# EAGLE schematic aleph-130111 (EAGLE 5.11)

## Sheet 1 of 8
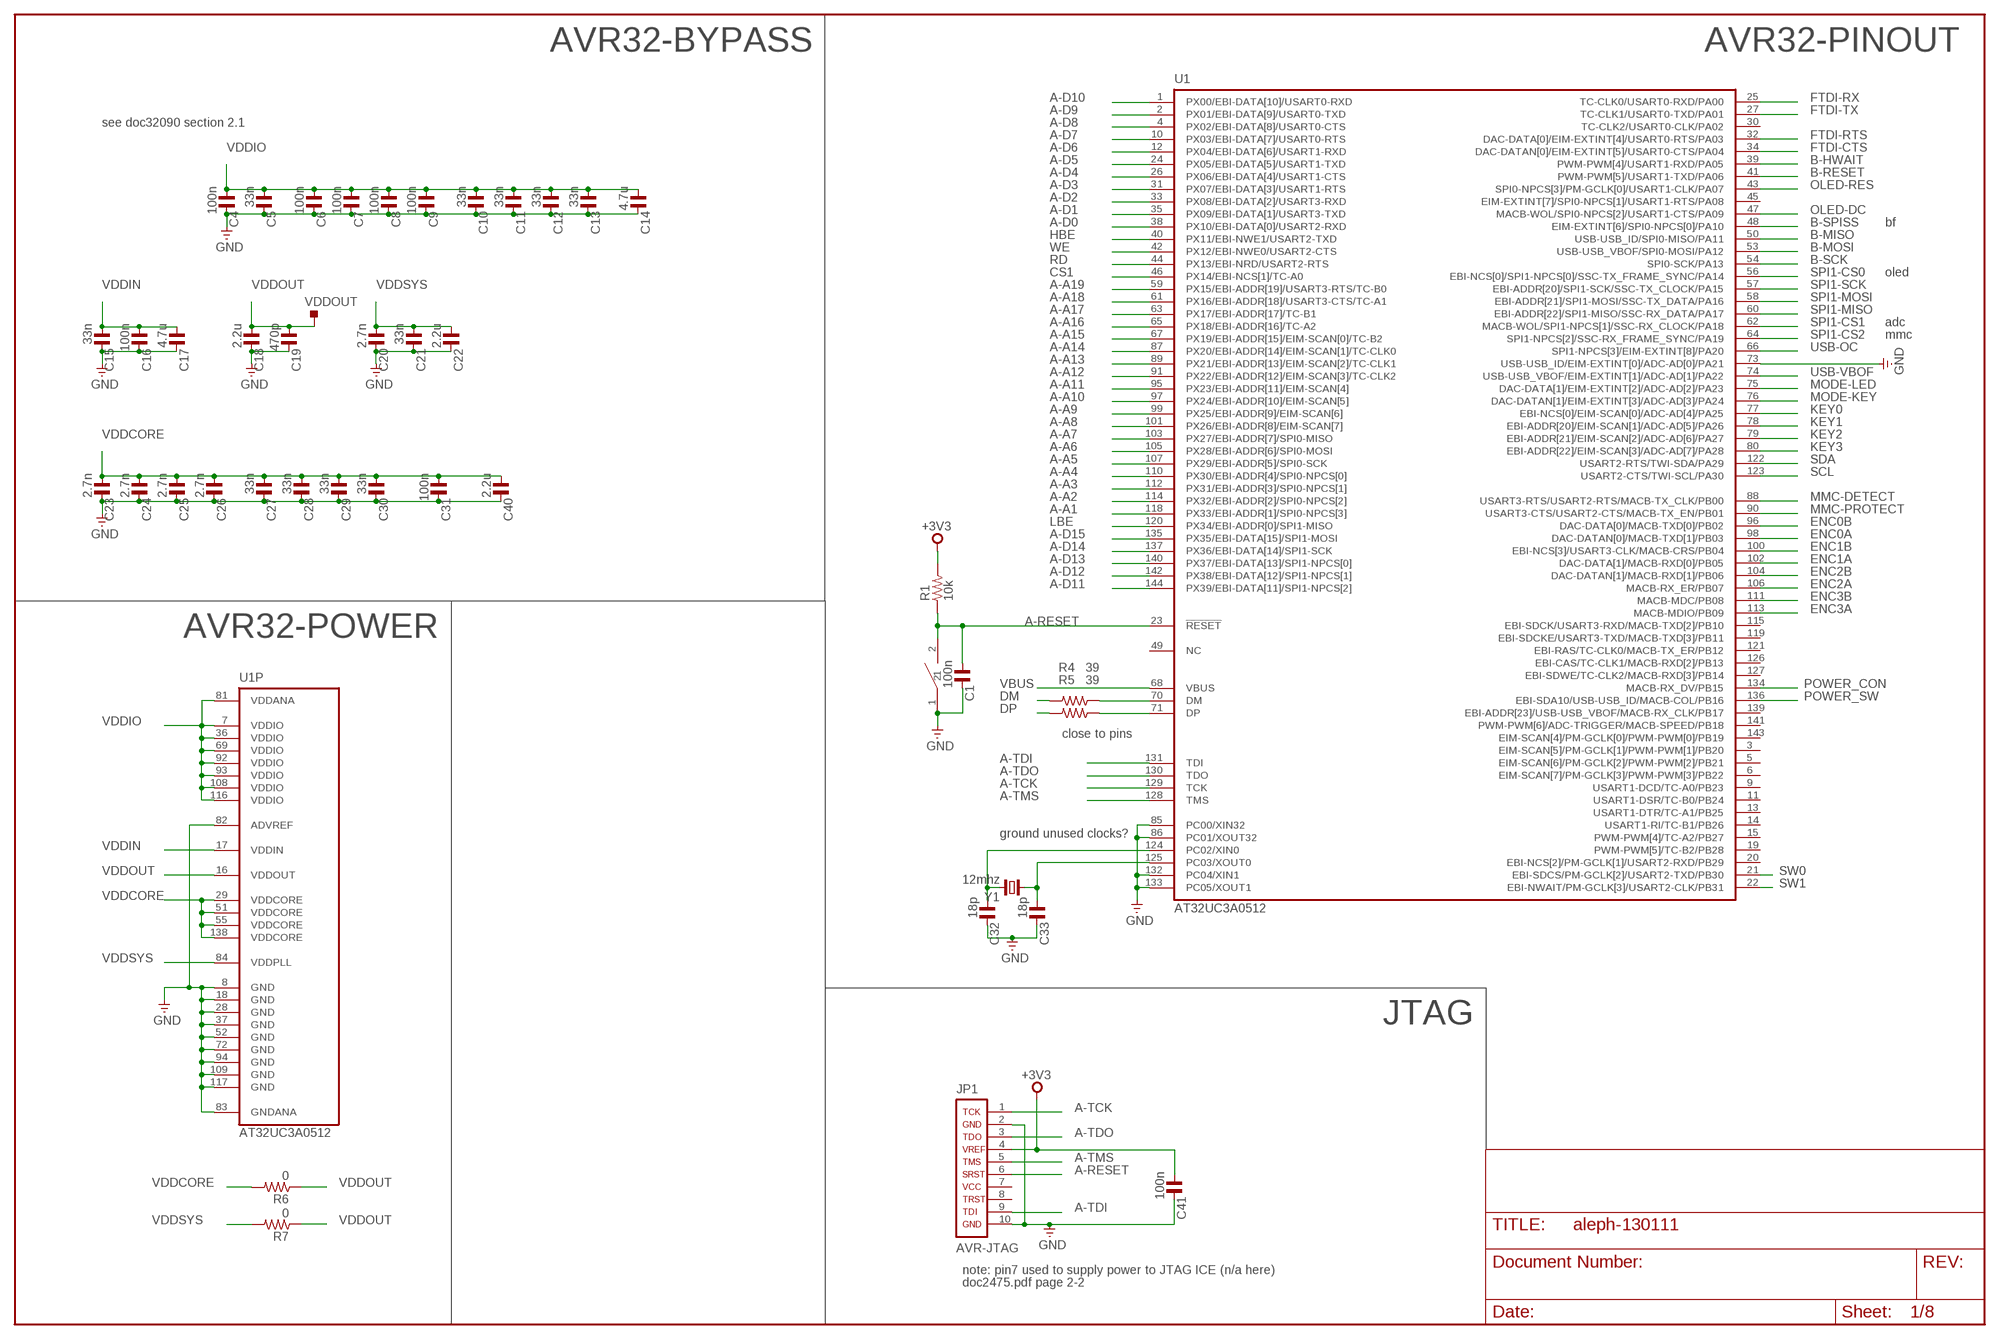
[diagram p0: schematic, sheet 1]

### Parts
C1  100n  C_0603  [C0603]
C4  100n  C_0603  [C0603]
C5  33n  C_0603  [C0603]
C6  100n  C_0603  [C0603]
C7  100n  C_0603  [C0603]
C8  100n  C_0603  [C0603]
C9  100n  C_0603  [C0603]
C10  33n  C_0603  [C0603]
C11  33n  C_0603  [C0603]
C12  33n  C_0603  [C0603]
C13  33n  C_0603  [C0603]
C14  4.7u  C_1206  [C1206]
C15  33n  C_0603  [C0603]
C16  100n  C_0603  [C0603]
C17  4.7u  C_1206  [C1206]
C18  2.2u  C_0603  [C0603]
C19  470p  C_0603  [C0603]
C20  2.7n  C_0603  [C0603]
C21  33n  C_0603  [C0603]
C22  2.2u  C_1206  [C1206]
C23  2.7n  C_0603  [C0603]
C24  2.7n  C_0603  [C0603]
C25  2.7n  C_0603  [C0603]
C26  2.7n  C_0603  [C0603]
C27  33n  C_0603  [C0603]
C28  33n  C_0603  [C0603]
C29  33n  C_0603  [C0603]
C30  33n  C_0603  [C0603]
C31  100n  C_0603  [C0603]
C32  18p  C_0603  [C0603]
C33  18p  C_0603  [C0603]
C40  2.2u  C_1206  [C1206]
C41  100n  C_0603  [C0603]
JP1  AVR-JTAG  AVR-JTAG-10  [AVR-JTAG-10]
R1  10k  R_0603  [R0603]
R4  39  R_0603  [R0603]
R5  39  R_0603  [R0603]
R6  0  R_0603  [R0603]
R7  0  R_0603  [R0603]
U1  AT32UC3A0512  AT32UC3A0128/0256/0512  [LQFP144]
U$1  PANASONIC-EVQ  [PANASONIC-EVQ]
VDDOUT  TPS-SMD-10R  [SMD-10R]
Y1  12mhz  CRYTALHC49UP  [HC49UP]

### Nets
+3V3: C41.1 JP1.4 R1.2 ; also sheet 2,3
A-A1: U1.118(PX33/EBI-ADDR[1]/SPI0-NPCS[3]) ; also sheet 2
A-A2: U1.114(PX32/EBI-ADDR[2]/SPI0-NPCS[2]) ; also sheet 2
A-A3: U1.112(PX31/EBI-ADDR[3]/SPI0-NPCS[1]) ; also sheet 2
A-A4: U1.110(PX30/EBI-ADDR[4]/SPI0-NPCS[0]) ; also sheet 2
A-A5: U1.107(PX29/EBI-ADDR[5]/SPI0-SCK) ; also sheet 2
A-A6: U1.105(PX28/EBI-ADDR[6]/SPI0-MOSI) ; also sheet 2
A-A7: U1.103(PX27/EBI-ADDR[7]/SPI0-MISO) ; also sheet 2
A-A8: U1.101(PX26/EBI-ADDR[8]/EIM-SCAN[7]) ; also sheet 2
A-A9: U1.99(PX25/EBI-ADDR[9]/EIM-SCAN[6]) ; also sheet 2
A-A10: U1.97(PX24/EBI-ADDR[10]/EIM-SCAN[5]) ; also sheet 2
A-A11: U1.95(PX23/EBI-ADDR[11]/EIM-SCAN[4]) ; also sheet 2
A-A12: U1.91(PX22/EBI-ADDR[12]/EIM-SCAN[3]/TC-CLK2) ; also sheet 2
A-A13: U1.89(PX21/EBI-ADDR[13]/EIM-SCAN[2]/TC-CLK1) ; also sheet 2
A-A14: U1.87(PX20/EBI-ADDR[14]/EIM-SCAN[1]/TC-CLK0) ; also sheet 2
A-A15: U1.67(PX19/EBI-ADDR[15]/EIM-SCAN[0]/TC-B2) ; also sheet 2
A-A16: U1.65(PX18/EBI-ADDR[16]/TC-A2) ; also sheet 2
A-A17: U1.63(PX17/EBI-ADDR[17]/TC-B1) ; also sheet 2
A-A18: U1.61(PX16/EBI-ADDR[18]/USART3-CTS/TC-A1) ; also sheet 2
A-A19: U1.59(PX15/EBI-ADDR[19]/USART3-RTS/TC-B0) ; also sheet 2
A-D0: U1.38(PX10/EBI-DATA[0]/USART2-RXD) ; also sheet 2
A-D1: U1.35(PX09/EBI-DATA[1]/USART3-TXD) ; also sheet 2
A-D2: U1.33(PX08/EBI-DATA[2]/USART3-RXD) ; also sheet 2
A-D3: U1.31(PX07/EBI-DATA[3]/USART1-RTS) ; also sheet 2
A-D4: U1.26(PX06/EBI-DATA[4]/USART1-CTS) ; also sheet 2
A-D5: U1.24(PX05/EBI-DATA[5]/USART1-TXD) ; also sheet 2
A-D6: U1.12(PX04/EBI-DATA[6]/USART1-RXD) ; also sheet 2
A-D7: U1.10(PX03/EBI-DATA[7]/USART0-RTS) ; also sheet 2
A-D8: U1.4(PX02/EBI-DATA[8]/USART0-CTS) ; also sheet 2
A-D9: U1.2(PX01/EBI-DATA[9]/USART0-TXD) ; also sheet 2
A-D10: U1.1(PX00/EBI-DATA[10]/USART0-RXD) ; also sheet 2
A-D11: U1.144(PX39/EBI-DATA[11]/SPI1-NPCS[2]) ; also sheet 2
A-D12: U1.142(PX38/EBI-DATA[12]/SPI1-NPCS[1]) ; also sheet 2
A-D13: U1.140(PX37/EBI-DATA[13]/SPI1-NPCS[0]) ; also sheet 2
A-D14: U1.137(PX36/EBI-DATA[14]/SPI1-SCK) ; also sheet 2
A-D15: U1.135(PX35/EBI-DATA[15]/SPI1-MOSI) ; also sheet 2
A-RESET: C1.1 JP1.6 R1.1 U1.23(!RESET) U$1.2
A-TCK: JP1.1 U1.129(TCK)
A-TDI: JP1.9 U1.131(TDI)
A-TDO: JP1.3 U1.130(TDO)
A-TMS: JP1.5 U1.128(TMS)
B-HWAIT: U1.39(PWM-PWM[4]/USART1-RXD/PA05) ; also sheet 4
B-MISO: U1.50(USB-USB_ID/SPI0-MISO/PA11) ; also sheet 4,5
B-MOSI: U1.53(USB-USB_VBOF/SPI0-MOSI/PA12) ; also sheet 4,5
B-RESET: U1.41(PWM-PWM[5]/USART1-TXD/PA06) ; also sheet 4
B-SCK: U1.54(SPI0-SCK/PA13) ; also sheet 4,5
B-SPISS: U1.48(EIM-EXTINT[6]/SPI0-NPCS[0]/PA10) ; also sheet 4
CS1: U1.46(PX14/EBI-NCS[1]/TC-A0) ; also sheet 2
DM: R4.2 ; also sheet 2
DP: R5.2 ; also sheet 2
ENC0A: U1.98(DAC-DATAN[0]/MACB-TXD[1]/PB03) ; also sheet 3
ENC0B: U1.96(DAC-DATA[0]/MACB-TXD[0]/PB02) ; also sheet 3
ENC1A: U1.102(DAC-DATA[1]/MACB-RXD[0]/PB05) ; also sheet 3
ENC1B: U1.100(EBI-NCS[3]/USART3-CLK/MACB-CRS/PB04) ; also sheet 3
ENC2A: U1.106(MACB-RX_ER/PB07) ; also sheet 3
ENC2B: U1.104(DAC-DATAN[1]/MACB-RXD[1]/PB06) ; also sheet 3
ENC3A: U1.113(MACB-MDIO/PB09) ; also sheet 3
ENC3B: U1.111(MACB-MDC/PB08) ; also sheet 3
FTDI-CTS: U1.34(DAC-DATAN[0]/EIM-EXTINT[5]/USART0-CTS/PA04) ; also sheet 2
FTDI-RTS: U1.32(DAC-DATA[0]/EIM-EXTINT[4]/USART0-RTS/PA03) ; also sheet 2
FTDI-RX: U1.25(TC-CLK0/USART0-RXD/PA00) ; also sheet 2
FTDI-TX: U1.27(TC-CLK1/USART0-TXD/PA01) ; also sheet 2
GND: C1.2 C4.2 C5.2 C6.2 C7.2 C8.2 C9.2 C10.2 C11.2 C12.2 C13.2 C14.2 C15.2 C16.2 C17.2 C18.2 C19.2 C20.2 C21.2 C22.2 C23.2 C24.2 C25.2 C26.2 C27.2 C28.2 C29.2 C30.2 C31.2 C32.2 C33.2 C40.2 C41.2 JP1.2 JP1.10 U1.8(GND) U1.18(GND) U1.28(GND) U1.37(GND) U1.52(GND) U1.72(GND) U1.73(USB-USB_ID/EIM-EXTINT[0]/ADC-AD[0]/PA21) U1.82(ADVREF) U1.83(GNDANA) U1.85(PC00/XIN32) U1.86(PC01/XOUT32) U1.94(GND) U1.109(GND) U1.117(GND) U1.132(PC04/XIN1) U1.133(PC05/XOUT1) U$1.1 ; also sheet 2,3,4,5
HBE: U1.40(PX11/EBI-NWE1/USART2-TXD) ; also sheet 2
KEY0: U1.77(EBI-NCS[0]/EIM-SCAN[0]/ADC-AD[4]/PA25) ; also sheet 3
KEY1: U1.78(EBI-ADDR[20]/EIM-SCAN[1]/ADC-AD[5]/PA26) ; also sheet 3
KEY2: U1.79(EBI-ADDR[21]/EIM-SCAN[2]/ADC-AD[6]/PA27) ; also sheet 3
KEY3: U1.80(EBI-ADDR[22]/EIM-SCAN[3]/ADC-AD[7]/PA28) ; also sheet 3
LBE: U1.120(PX34/EBI-ADDR[0]/SPI1-MISO) ; also sheet 2
MMC-DETECT: U1.88(USART3-RTS/USART2-RTS/MACB-TX_CLK/PB00) ; also sheet 3
MMC-PROTECT: U1.90(USART3-CTS/USART2-CTS/MACB-TX_EN/PB01) ; also sheet 3
MODE-KEY: U1.76(DAC-DATAN[1]/EIM-EXTINT[3]/ADC-AD[3]/PA24) ; also sheet 3
MODE-LED: U1.75(DAC-DATA[1]/EIM-EXTINT[2]/ADC-AD[2]/PA23) ; also sheet 3
N$4: C32.1 U1.124(PC02/XIN0) Y1.2
N$5: C33.1 U1.125(PC03/XOUT0) Y1.1
N$44: R4.1 U1.70(DM)
N$45: R5.1 U1.71(DP)
OLED-DC: U1.47(MACB-WOL/SPI0-NPCS[2]/USART1-CTS/PA09) ; also sheet 3
OLED-RES: U1.43(SPI0-NPCS[3]/PM-GCLK[0]/USART1-CLK/PA07) ; also sheet 3
POWER_CON: U1.134(MACB-RX_DV/PB15) ; also sheet 2
POWER_SW: U1.136(EBI-SDA10/USB-USB_ID/MACB-COL/PB16) ; also sheet 2
RD: U1.44(PX13/EBI-NRD/USART2-RTS) ; also sheet 2
SCL: U1.123(USART2-CTS/TWI-SCL/PA30) ; also sheet 3
SDA: U1.122(USART2-RTS/TWI-SDA/PA29) ; also sheet 3
SPI1-CS0: U1.56(EBI-NCS[0]/SPI1-NPCS[0]/SSC-TX_FRAME_SYNC/PA14) ; also sheet 3
SPI1-CS1: U1.62(MACB-WOL/SPI1-NPCS[1]/SSC-RX_CLOCK/PA18) ; also sheet 3
SPI1-CS2: U1.64(SPI1-NPCS[2]/SSC-RX_FRAME_SYNC/PA19) ; also sheet 3
SPI1-MISO: U1.60(EBI-ADDR[22]/SPI1-MISO/SSC-RX_DATA/PA17) ; also sheet 3
SPI1-MOSI: U1.58(EBI-ADDR[21]/SPI1-MOSI/SSC-TX_DATA/PA16) ; also sheet 3
SPI1-SCK: U1.57(EBI-ADDR[20]/SPI1-SCK/SSC-TX_CLOCK/PA15) ; also sheet 3
SW0: U1.21(EBI-SDCS/PM-GCLK[2]/USART2-TXD/PB30) ; also sheet 3
SW1: U1.22(EBI-NWAIT/PM-GCLK[3]/USART2-CLK/PB31) ; also sheet 3
USB-OC: U1.66(SPI1-NPCS[3]/EIM-EXTINT[8]/PA20) ; also sheet 2
USB-VBOF: U1.74(USB-USB_VBOF/EIM-EXTINT[1]/ADC-AD[1]/PA22) ; also sheet 2
VBUS: U1.68(VBUS) ; also sheet 2
VDDCORE: C23.1 C24.1 C25.1 C26.1 C27.1 C28.1 C29.1 C30.1 C31.1 C40.1 R6.2 U1.29(VDDCORE) U1.51(VDDCORE) U1.55(VDDCORE) U1.138(VDDCORE)
VDDIN: C15.1 C16.1 C17.1 U1.17(VDDIN) ; also sheet 2
VDDIO: C4.1 C5.1 C6.1 C7.1 C8.1 C9.1 C10.1 C11.1 C12.1 C13.1 C14.1 U1.7(VDDIO) U1.36(VDDIO) U1.69(VDDIO) U1.81(VDDANA) U1.92(VDDIO) U1.93(VDDIO) U1.108(VDDIO) U1.116(VDDIO) ; also sheet 2
VDDOUT: C18.1 C19.1 R6.1 R7.1 U1.16(VDDOUT) VDDOUT.TP
VDDSYS: C20.1 C21.1 C22.1 R7.2 U1.84(VDDPLL)
WE: U1.42(PX12/EBI-NWE0/USART2-CTS) ; also sheet 2
Unconnected: JP1.7 JP1.8 U1.3(EIM-SCAN[5]/PM-GCLK[1]/PWM-PWM[1]/PB20) U1.5(EIM-SCAN[6]/PM-GCLK[2]/PWM-PWM[2]/PB21) U1.6(EIM-SCAN[7]/PM-GCLK[3]/PWM-PWM[3]/PB22) U1.9(USART1-DCD/TC-A0/PB23) U1.11(USART1-DSR/TC-B0/PB24) U1.13(USART1-DTR/TC-A1/PB25) U1.14(USART1-RI/TC-B1/PB26) U1.15(PWM-PWM[4]/TC-A2/PB27) U1.19(PWM-PWM[5]/TC-B2/PB28) U1.20(EBI-NCS[2]/PM-GCLK[1]/USART2-RXD/PB29) U1.30(TC-CLK2/USART0-CLK/PA02) U1.45(EIM-EXTINT[7]/SPI0-NPCS[1]/USART1-RTS/PA08) U1.49(NC) U1.115(EBI-SDCK/USART3-RXD/MACB-TXD[2]/PB10) U1.119(EBI-SDCKE/USART3-TXD/MACB-TXD[3]/PB11) U1.121(EBI-RAS/TC-CLK0/MACB-TX_ER/PB12) U1.126(EBI-CAS/TC-CLK1/MACB-RXD[2]/PB13) U1.127(EBI-SDWE/TC-CLK2/MACB-RXD[3]/PB14) U1.139(EBI-ADDR[23]/USB-USB_VBOF/MACB-RX_CLK/PB17) U1.141(PWM-PWM[6]/ADC-TRIGGER/MACB-SPEED/PB18) U1.143(EIM-SCAN[4]/PM-GCLK[0]/PWM-PWM[0]/PB19)

### Notes on the sheet
- AVR32-BYPASS | AVR32-PINOUT
- see doc32090 section 2.1
- bf
- oled
- adc
- mmc
- AVR32-POWER
- close to pins
- ground unused clocks?
- JTAG
- note: pin7 used to supply power to JTAG ICE (n/a here)
- doc2475.pdf page 2-2

## Sheet 2 of 8
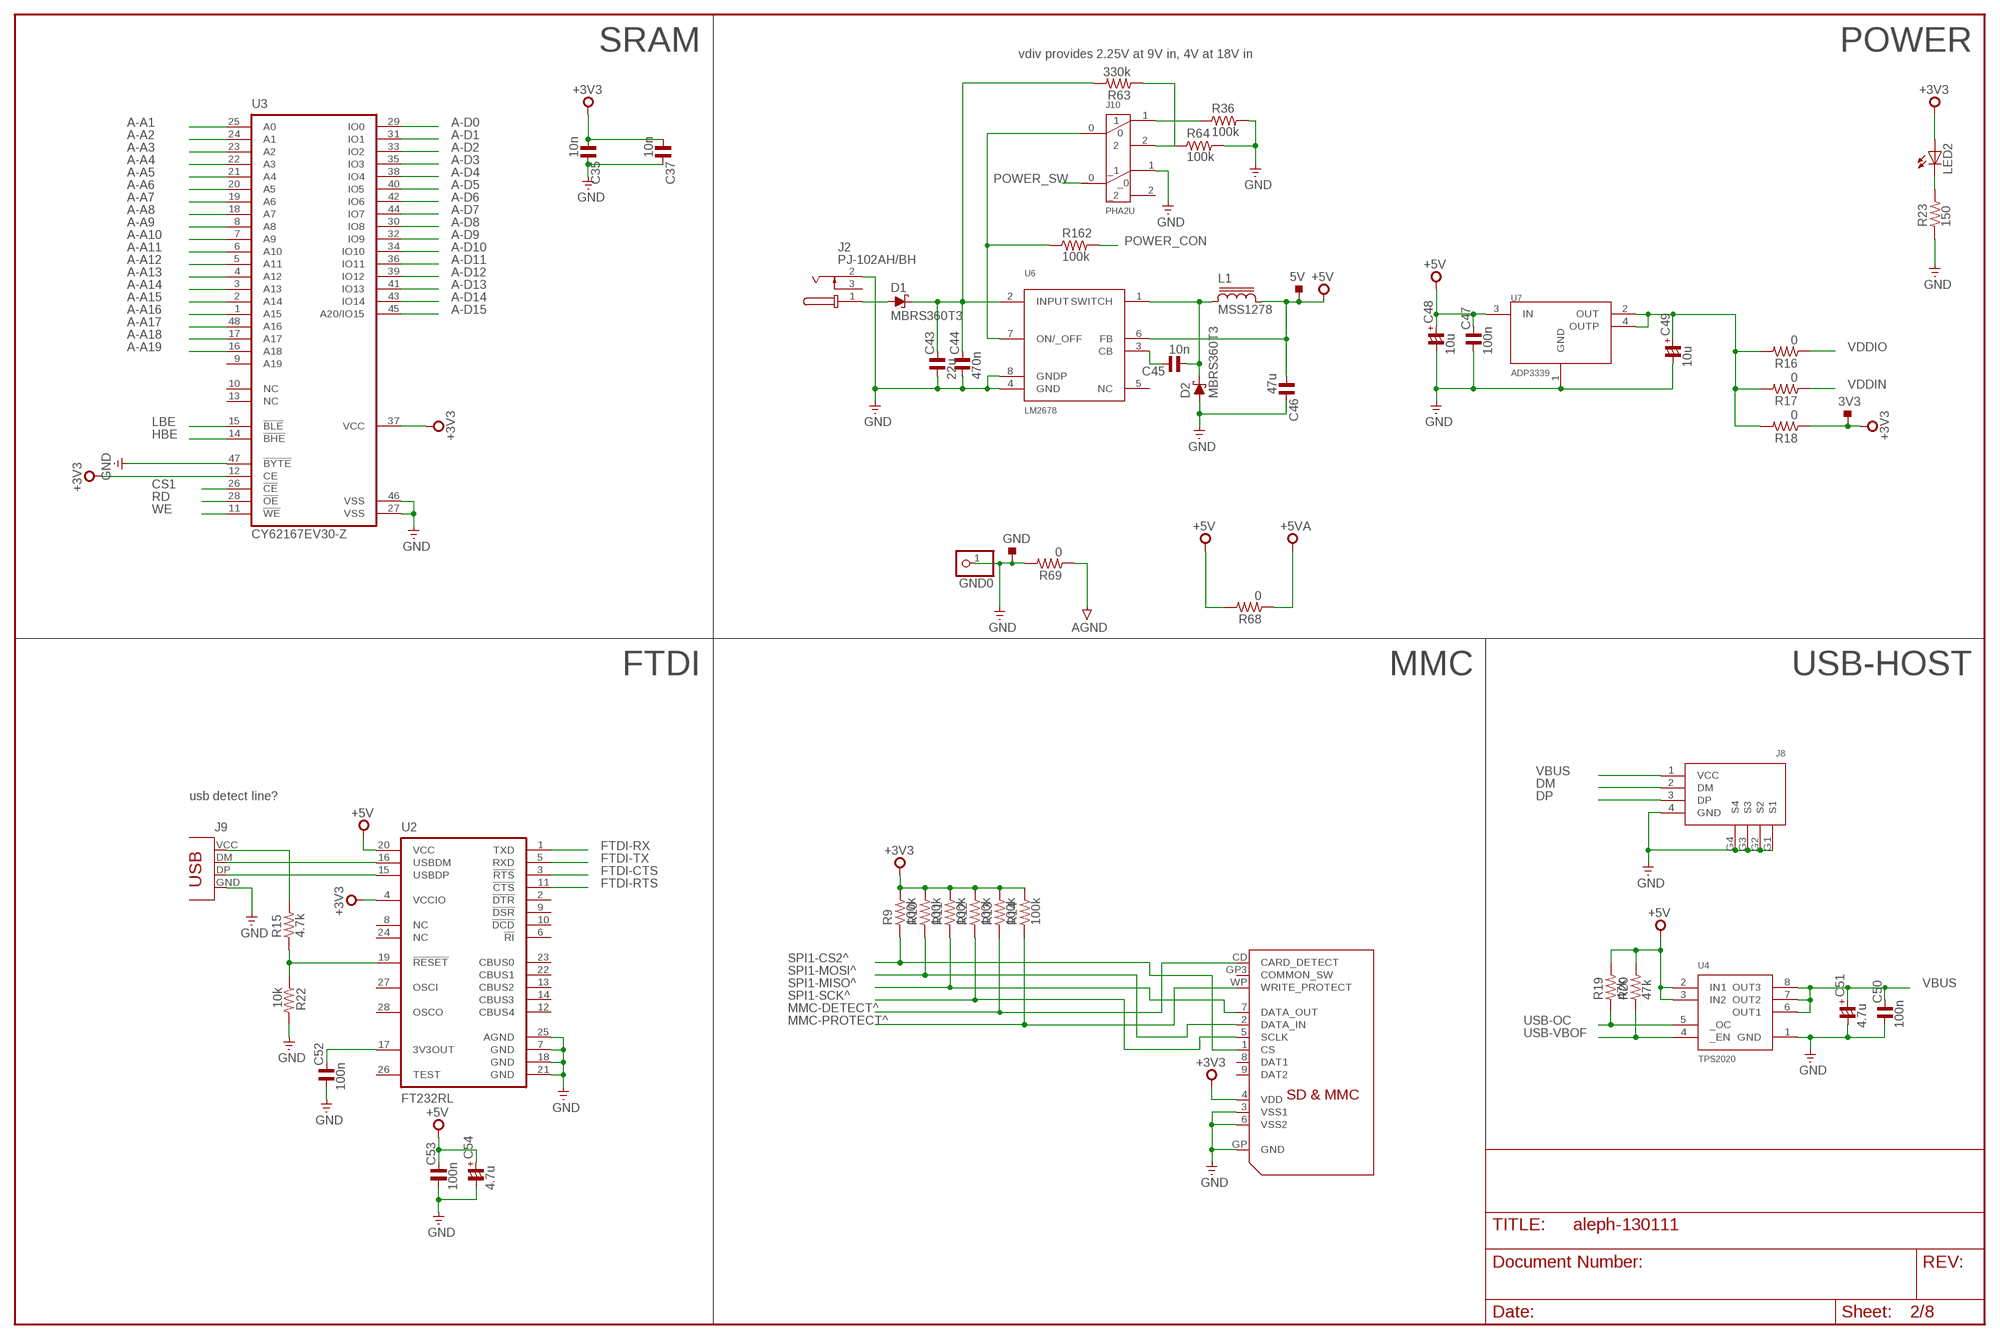
[diagram p1: schematic, sheet 2]

### Parts
3V3  TPS-SMD-15R  [SMD-15R]
5V  TPS-SMD-15R  [SMD-15R]
C35  10n  C_0603  [C0603]
C37  10n  C_0603  [C0603]
C43  22u  C_1206  [C1206]
C44  470n  C_1206  [C1206]
C45  10n  C_1206  [C1206]
C46  47u  C_3225  [C3225]
C47  100n  C_1206  [C1206]
C48  10u  CP_1206/T  [C1206/T]
C49  10u  CP_1206/T  [C1206/T]
C50  100n  C_0603  [C0603]
C51  4.7u  CP_1206/T  [C1206/T]
C52  100n  C_0603  [C0603]
C53  100n  C_0603  [C0603]
C54  4.7u  CP_1206/T  [C1206/T]
D1  MBRS360T3  [SMC]
D2  MBRS360T3  [SMC]
GND  TPS-SMD-20R  [SMD-20R]
GND0  PINHD-1X1  [1X01]
J2  PJ-102AH/BH  [PJ-102XH]
J8  USBA-VERT  [USBA-VERT]
J9  USB_TYPE_B  [USB_B]
J10  PHA2U  [PHA2U]
L1  MSS1278  [MSS1278]
LED2  LEDCHIPLED_1206  [CHIPLED_1206]
R9  100k  R_0603  [R0603]
R10  100k  R_0603  [R0603]
R11  100k  R_0603  [R0603]
R12  100k  R_0603  [R0603]
R13  100k  R_0603  [R0603]
R14  100k  R_0603  [R0603]
R15  4.7k  R_0603  [R0603]
R16  0  R_0603  [R0603]
R17  0  R_0603  [R0603]
R18  0  R_0603  [R0603]
R19  47k  R_0603  [R0603]
R20  47k  R_0603  [R0603]
R22  10k  R_0603  [R0603]
R23  150  R_0603  [R0603]
R36  100k  R_0603  [R0603]
R63  330k  R_0603  [R0603]
R64  100k  R_0603  [R0603]
R68  0  R_0603  [R0603]
R69  0  R_0603  [R0603]
R162  100k  R_0603  [R0603]
U2  FT232RL  [SSOP28]
U3  CY62167EV30-Z  [TSOP48]
U4  TPS2020  [SO08]
U6  LM2678  [TO263-7]
U7  ADP3339  [SOT223]
U$6  SDMMC06132  [06132]

### Nets
+3V3: 3V3.TP C35.1 C37.1 LED2.A R9.2 R10.2 R11.2 R12.2 R13.2 R14.2 R18.1 U2.4(VCCIO) U3.12(CE) U3.37(VCC) U$6.4(VDD) ; also sheet 1,3
+5V: 5V.TP C46.1 C47.2 C48.+ C53.2 C54.+ L1.2 R19.2 R20.2 R68.2 U2.20(VCC) U4.2(IN1) U4.3(IN2) U6.6(FB) U7.3(IN) ; also sheet 3,4
+5VA: R68.1 ; also sheet 3,8
A-A1: U3.25(A0) ; also sheet 1
A-A2: U3.24(A1) ; also sheet 1
A-A3: U3.23(A2) ; also sheet 1
A-A4: U3.22(A3) ; also sheet 1
A-A5: U3.21(A4) ; also sheet 1
A-A6: U3.20(A5) ; also sheet 1
A-A7: U3.19(A6) ; also sheet 1
A-A8: U3.18(A7) ; also sheet 1
A-A9: U3.8(A8) ; also sheet 1
A-A10: U3.7(A9) ; also sheet 1
A-A11: U3.6(A10) ; also sheet 1
A-A12: U3.5(A11) ; also sheet 1
A-A13: U3.4(A12) ; also sheet 1
A-A14: U3.3(A13) ; also sheet 1
A-A15: U3.2(A14) ; also sheet 1
A-A16: U3.1(A15) ; also sheet 1
A-A17: U3.48(A16) ; also sheet 1
A-A18: U3.17(A17) ; also sheet 1
A-A19: U3.16(A18) ; also sheet 1
A-D0: U3.29(IO0) ; also sheet 1
A-D1: U3.31(IO1) ; also sheet 1
A-D2: U3.33(IO2) ; also sheet 1
A-D3: U3.35(IO3) ; also sheet 1
A-D4: U3.38(IO4) ; also sheet 1
A-D5: U3.40(IO5) ; also sheet 1
A-D6: U3.42(IO6) ; also sheet 1
A-D7: U3.44(IO7) ; also sheet 1
A-D8: U3.30(IO8) ; also sheet 1
A-D9: U3.32(IO9) ; also sheet 1
A-D10: U3.34(IO10) ; also sheet 1
A-D11: U3.36(IO11) ; also sheet 1
A-D12: U3.39(IO12) ; also sheet 1
A-D13: U3.41(IO13) ; also sheet 1
A-D14: U3.43(IO14) ; also sheet 1
A-D15: U3.45(A20/IO15) ; also sheet 1
AGND: R69.1 ; also sheet 3,5,6,7,8
CS1: U3.26(!CE!) ; also sheet 1
DM: J8.2(DM) ; also sheet 1
DP: J8.3(DP) ; also sheet 1
FTDI-CTS: U2.3(!RTS!) ; also sheet 1
FTDI-RTS: U2.11(!CTS!) ; also sheet 1
FTDI-RX: U2.1(TXD) ; also sheet 1
FTDI-TX: U2.5(RXD) ; also sheet 1
GND: C35.2 C37.2 C43.1 C44.1 C46.2 C47.1 C48.- C49.- C50.1 C51.- C52.1 C53.1 C54.- D2.A GND0.1 GND.TP J2.2(S) J8.4(GND) J8.G1(S1) J8.G2(S2) J8.G3(S3) J8.G4(S4) J9.GND J10._1 R22.2 R23.1 R36.2 R64.2 R69.2 U2.7(GND) U2.18(GND) U2.21(GND) U2.25(AGND) U3.27(VSS) U3.46(VSS) U3.47(!BYTE!) U4.1(GND) U6.4(GND) U6.8(GNDP) U7.1(GND) U$6.3(VSS1) U$6.6(VSS2) U$6.GP(GND) ; also sheet 1,3,4,5
HBE: U3.14(!BHE!) ; also sheet 1
LBE: U3.15(!BLE!) ; also sheet 1
MMC-DETECT^: R13.1 U$6.CD(CARD_DETECT) ; also sheet 3
MMC-PROTECT^: R14.1 U$6.WP(WRITE_PROTECT) ; also sheet 3
N$1: C43.2 C44.2 D1.C R63.2 U6.2(INPUT)
N$3: D1.A J2.1(T)
N$6: R15.1 R22.1 U2.19(!RESET!)
N$7: C45.1 D2.C L1.1 U6.1(SWITCH)
N$9: C45.2 U6.3(CB)
N$12: J9.DM(USBDM) U2.16(USBDM)
N$13: J9.DP(USBDP) U2.15(USBDP)
N$14: C52.2 U2.17(3V3OUT)
N$15: LED2.C R23.2
N$17: J9.VCC R15.2
N$32: C49.+ R16.2 R17.2 R18.2 U7.2(OUT) U7.4(OUTP)
N$50: J10.1 R36.1
N$55: J10.2 R63.1 R64.1
N$56: J10.0 R162.1 U6.7(ON/_OFF)
POWER_CON: R162.2 ; also sheet 1
POWER_SW: J10._0 ; also sheet 1
RD: U3.28(!OE!) ; also sheet 1
SPI1-CS2^: R9.1 U$6.1(CS) ; also sheet 3
SPI1-MISO^: R11.1 U$6.7(DATA_OUT) ; also sheet 3
SPI1-MOSI^: R10.1 U$6.2(DATA_IN) ; also sheet 3
SPI1-SCK^: R12.1 U$6.5(SCLK) ; also sheet 3
USB-OC: R19.1 U4.5(_OC) ; also sheet 1
USB-VBOF: R20.1 U4.4(_EN) ; also sheet 1
VBUS: C50.2 C51.+ J8.1(VCC) U4.6(OUT1) U4.7(OUT2) U4.8(OUT3) ; also sheet 1
VDDIN: R17.1 ; also sheet 1
VDDIO: R16.1 ; also sheet 1
WE: U3.11(!WE!) ; also sheet 1
Unconnected: J2.3(SS) J10._2 U2.2(!DTR!) U2.6(!RI!) U2.8(NC) U2.9(!DSR!) U2.10(!DCD!) U2.12(CBUS4) U2.13(CBUS2) U2.14(CBUS3) U2.22(CBUS1) U2.23(CBUS0) U2.24(NC) U2.26(TEST) U2.27(OSCI) U2.28(OSCO) U3.9(A19) U3.10(NC) U3.13(NC) U6.5(NC) U$6.8(DAT1) U$6.9(DAT2) U$6.GP3(COMMON_SW)

### Notes on the sheet
- SRAM | POWER
- vdiv provides 2.25V at 9V in, 4V at 18V in
- FTDI | MMC | USB-HOST
- usb detect line?

## Sheet 3 of 8
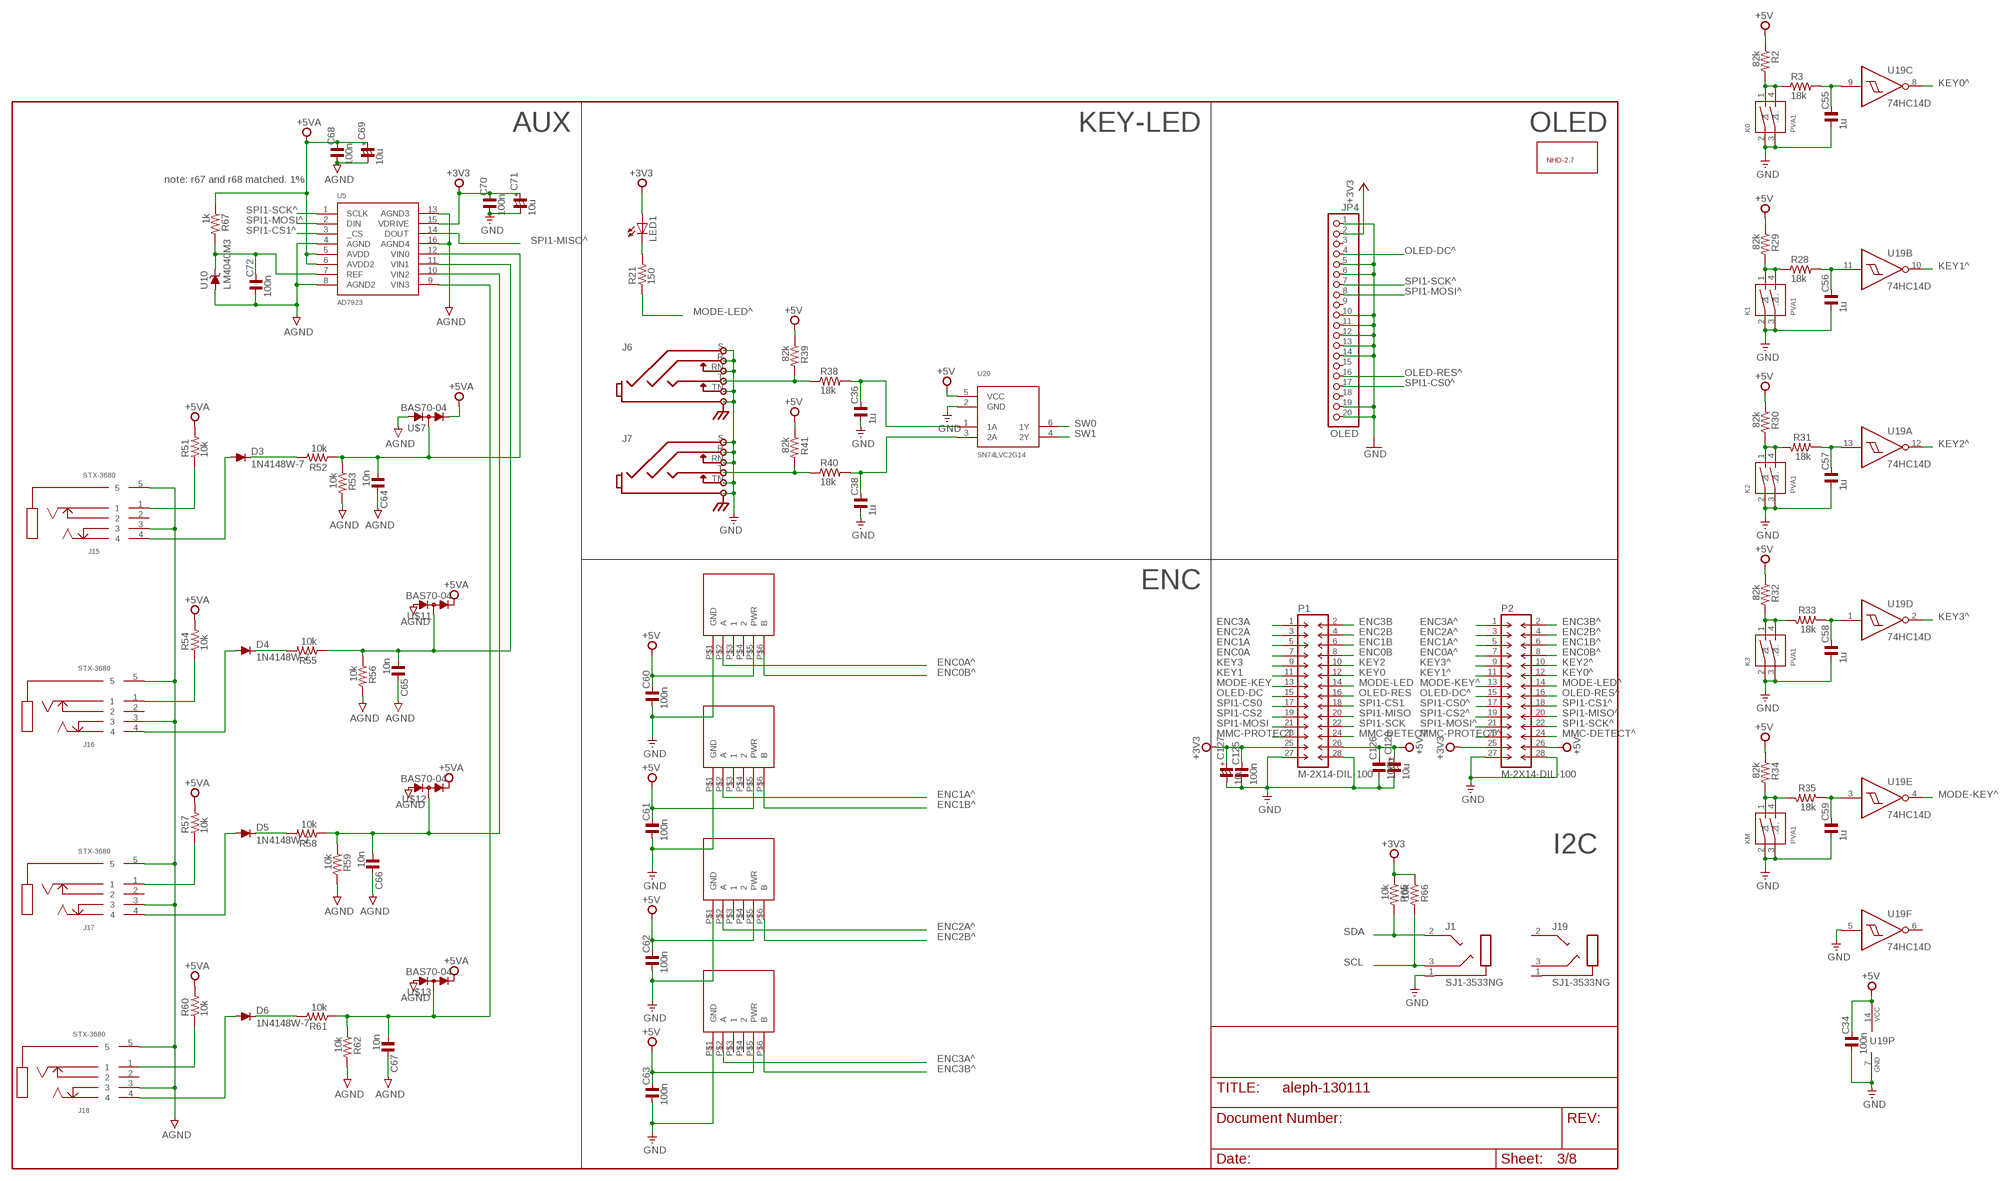
[diagram p2: schematic, sheet 3]

### Parts
C34  100n  C_0603  [C0603]
C36  1u  C_0603  [C0603]
C38  1u  C_0603  [C0603]
C55  1u  C_0603  [C0603]
C56  1u  C_0603  [C0603]
C57  1u  C_0603  [C0603]
C58  1u  C_0603  [C0603]
C59  1u  C_0603  [C0603]
C60  100n  C_0603  [C0603]
C61  100n  C_0603  [C0603]
C62  100n  C_0603  [C0603]
C63  100n  C_0603  [C0603]
C64  10n  C_0603  [C0603]
C65  10n  C_0603  [C0603]
C66  10n  C_0603  [C0603]
C67  10n  C_0603  [C0603]
C68  100n  C_0603  [C0603]
C69  10u  CP_1206/T  [C1206/T]
C70  100n  C_0603  [C0603]
C71  10u  CP_1206/T  [C1206/T]
C72  100n  C_0603  [C0603]
C125  100n  C_0603  [C0603]
C126  100n  C_0603  [C0603]
C127  10u  CP_1206/T  [C1206/T]
C128  10u  CP_1206/T  [C1206/T]
D3  1N4148W-7  [SOD123]
D4  1N4148W-7  [SOD123]
D5  1N4148W-7  [SOD123]
D6  1N4148W-7  [SOD123]
J1  SJ1-3533NG  [SJ1-3533NG]
J6  STEREOSW2GND  [NEUTRIK-NRJ6HM-1]
J7  STEREOSW2GND  [NEUTRIK-NRJ6HM-1]
J15  STX-3680  [STX-3680]
J16  STX-3680  [STX-3680]
J17  STX-3680  [STX-3680]
J18  STX-3680  [STX-3680]
J19  SJ1-3533NG  [SJ1-3533NG]
JP4  OLED  PINHD-1X20  [1X20]
K0  PVA1  [PVA1]
K1  PVA1  [PVA1]
K2  PVA1  [PVA1]
K3  PVA1  [PVA1]
KM  PVA1  [PVA1]
LED1  LEDCHIPLED_1206  [CHIPLED_1206]
P1  M-2X14-DIL-100  [DIL-100-2X14]
P2  M-2X14-DIL-100  [DIL-100-2X14]
R2  82k  R_0603  [R0603]
R3  18k  R_0603  [R0603]
R21  150  R_0603  [R0603]
R28  18k  R_0603  [R0603]
R29  82k  R_0603  [R0603]
R30  82k  R_0603  [R0603]
R31  18k  R_0603  [R0603]
R32  82k  R_0603  [R0603]
R33  18k  R_0603  [R0603]
R34  82k  R_0603  [R0603]
R35  18k  R_0603  [R0603]
R38  18k  R_0603  [R0603]
R39  82k  R_0603  [R0603]
R40  18k  R_0603  [R0603]
R41  82k  R_0603  [R0603]
R51  10k  R_0603  [R0603]
R52  10k  R_0603  [R0603]
R53  10k  R_0603  [R0603]
R54  10k  R_0603  [R0603]
R55  10k  R_0603  [R0603]
R56  10k  R_0603  [R0603]
R57  10k  R_0603  [R0603]
R58  10k  R_0603  [R0603]
R59  10k  R_0603  [R0603]
R60  10k  R_0603  [R0603]
R61  10k  R_0603  [R0603]
R62  10k  R_0603  [R0603]
R65  10k  R_0603  [R0603]
R66  10k  R_0603  [R0603]
R67  1k  R_0603  [R0603]
U5  AD7923  [TSSOP16]
U10  LM4040M3  [SOT23]
U19  74HC14D  [SO14]
U20  SN74LVC2G14  [SOT23-6]
U$2  BOURNS-EM14  [BOURNS-EM14]
U$3  BOURNS-EM14  [BOURNS-EM14]
U$4  BOURNS-EM14  [BOURNS-EM14]
U$5  BOURNS-EM14  [BOURNS-EM14]
U$7  BAS70-04  [SOT23]
U$10  NHD-2.7  [NHD-2.7]
U$11  BAS70-04  [SOT23]
U$12  BAS70-04  [SOT23]
U$13  BAS70-04  [SOT23]

### Nets
+3V3: C70.2 C71.+ C125.2 C127.+ JP4.2 LED1.A P1.25 P2.25 R65.1 R66.1 U5.15(VDRIVE) ; also sheet 1,2
+5V: C34.2 C60.2 C61.2 C62.2 C63.2 C126.2 C128.+ P1.26 P2.26 R2.1 R29.1 R30.1 R32.1 R34.1 R39.1 R41.1 U19.14(P:VCC) U20.5(VCC) U$2.P$5(PWR) U$3.P$5(PWR) U$4.P$5(PWR) U$5.P$5(PWR) ; also sheet 2,4
+5VA: C68.2 C69.+ R51.2 R54.2 R57.2 R60.2 R67.1 U5.5(AVDD) U5.6(AVDD2) U$7.2(C) U$11.2(C) U$12.2(C) U$13.2(C) ; also sheet 2,8
AGND: C64.2 C65.2 C66.2 C67.2 C68.1 C69.- C72.1 J15.3 J15.5 J16.3 J16.5 J17.3 J17.5 J18.3 J18.5 R53.2 R56.2 R59.2 R62.2 U5.4(AGND) U5.8(AGND2) U5.13(AGND3) U5.16(AGND4) U10.2(A) U$7.1(A) U$11.1(A) U$12.1(A) U$13.1(A) ; also sheet 2,5,6,7,8
ENC0A: P1.7 ; also sheet 1
ENC0A^: P2.7 U$2.P$2(A)
ENC0B: P1.8 ; also sheet 1
ENC0B^: P2.8 U$2.P$6(B)
ENC1A: P1.5 ; also sheet 1
ENC1A^: P2.5 U$3.P$2(A)
ENC1B: P1.6 ; also sheet 1
ENC1B^: P2.6 U$3.P$6(B)
ENC2A: P1.3 ; also sheet 1
ENC2A^: P2.3 U$4.P$2(A)
ENC2B: P1.4 ; also sheet 1
ENC2B^: P2.4 U$4.P$6(B)
ENC3A: P1.1 ; also sheet 1
ENC3A^: P2.1 U$5.P$2(A)
ENC3B: P1.2 ; also sheet 1
ENC3B^: P2.2 U$5.P$6(B)
GND: C34.1 C36.1 C38.1 C55.1 C56.1 C57.1 C58.1 C59.1 C60.1 C61.1 C62.1 C63.1 C70.1 C71.- C125.1 C126.1 C127.- C128.- J1.1(S) J6.R J6.RN J6.S J6.TN J7.R J7.RN J7.S J7.TN JP4.1 JP4.5 JP4.6 JP4.10 JP4.11 JP4.12 JP4.13 JP4.14 JP4.19 JP4.20 K0.2 K0.3(1.) K1.2 K1.3(1.) K2.2 K2.3(1.) K3.2 K3.3(1.) KM.2 KM.3(1.) P1.27 P1.28 P2.27 P2.28 U19.5(F:I) U19.7(P:GND) U20.2(GND) U$2.P$1(GND) U$3.P$1(GND) U$4.P$1(GND) U$5.P$1(GND) ; also sheet 1,2,4,5
KEY0: P1.12 ; also sheet 1
KEY0^: P2.12 U19.8(C:O)
KEY1: P1.11 ; also sheet 1
KEY1^: P2.11 U19.10(B:O)
KEY2: P1.10 ; also sheet 1
KEY2^: P2.10 U19.12(A:O)
KEY3: P1.9 ; also sheet 1
KEY3^: P2.9 U19.2(D:O)
MMC-DETECT: P1.24 ; also sheet 1
MMC-DETECT^: P2.24 ; also sheet 2
MMC-PROTECT: P1.23 ; also sheet 1
MMC-PROTECT^: P2.23 ; also sheet 2
MODE-KEY: P1.13 ; also sheet 1
MODE-KEY^: P2.13 U19.4(E:O)
MODE-LED: P1.14 ; also sheet 1
MODE-LED^: P2.14 R21.1
N$2: K0.1 K0.4(.2) R2.2 R3.1
N$8: C55.2 R3.2 U19.9(C:I)
N$10: K1.1 K1.4(.2) R28.1 R29.2
N$11: C56.2 R28.2 U19.11(B:I)
N$20: LED1.C R21.2
N$21: K2.1 K2.4(.2) R30.2 R31.2
N$23: C57.2 R31.1 U19.13(A:I)
N$27: K3.1 K3.4(.2) R32.2 R33.2
N$30: C58.2 R33.1 U19.1(D:I)
N$33: J17.1 R57.1
N$34: D3.A J15.4
N$37: D4.C R55.2
N$39: D3.C R52.2
N$40: D5.C R58.2
N$41: J16.1 R54.1
N$42: D4.A J16.4
N$43: KM.1 KM.4(.2) R34.2 R35.2
N$46: D6.C R61.2
N$47: J15.1 R51.1
N$48: D5.A J17.4
N$49: C59.2 R35.1 U19.3(E:I)
N$51: J18.1 R60.1
N$52: D6.A J18.4
N$53: J7.T R40.1 R41.2
N$54: C38.2 R40.2 U20.3(2A)
N$58: C72.2 R67.2 U5.7(REF) U10.1(C)
N$116: C65.1 R55.1 R56.1 U5.11(VIN1) U$11.3(AC)
N$117: C66.1 R58.1 R59.1 U5.10(VIN2) U$12.3(AC)
N$118: C67.1 R61.1 R62.1 U5.9(VIN3) U$13.3(AC)
N$119: C64.1 R52.1 R53.1 U5.12(VIN0) U$7.3(AC)
N$120: J6.T R38.1 R39.2
N$124: C36.2 R38.2 U20.1(1A)
OLED-DC: P1.15 ; also sheet 1
OLED-DC^: JP4.4 P2.15
OLED-RES: P1.16 ; also sheet 1
OLED-RES^: JP4.16 P2.16
SCL: J1.3(R) R66.2 ; also sheet 1
SDA: J1.2(T) R65.2 ; also sheet 1
SPI1-CS0: P1.17 ; also sheet 1
SPI1-CS0^: JP4.17 P2.17
SPI1-CS1: P1.18 ; also sheet 1
SPI1-CS1^: P2.18 U5.3(_CS)
SPI1-CS2: P1.19 ; also sheet 1
SPI1-CS2^: P2.19 ; also sheet 2
SPI1-MISO: P1.20 ; also sheet 1
SPI1-MISO^: P2.20 U5.14(DOUT) ; also sheet 2
SPI1-MOSI: P1.21 ; also sheet 1
SPI1-MOSI^: JP4.8 P2.21 U5.2(DIN) ; also sheet 2
SPI1-SCK: P1.22 ; also sheet 1
SPI1-SCK^: JP4.7 P2.22 U5.1(SCLK) ; also sheet 2
SW0: U20.6(1Y) ; also sheet 1
SW1: U20.4(2Y) ; also sheet 1
Unconnected: J15.2 J16.2 J17.2 J18.2 J19.1(S) J19.2(T) J19.3(R) JP4.3 JP4.9 JP4.15 JP4.18 U19.6(F:O) U$2.P$3 U$2.P$4 U$3.P$3 U$3.P$4 U$4.P$3 U$4.P$4 U$5.P$3 U$5.P$4

### Notes on the sheet
- AUX | KEY-LED | OLED
- note: r67 and r68 matched. 1%
- ENC
- I2C

## Sheet 4 of 8
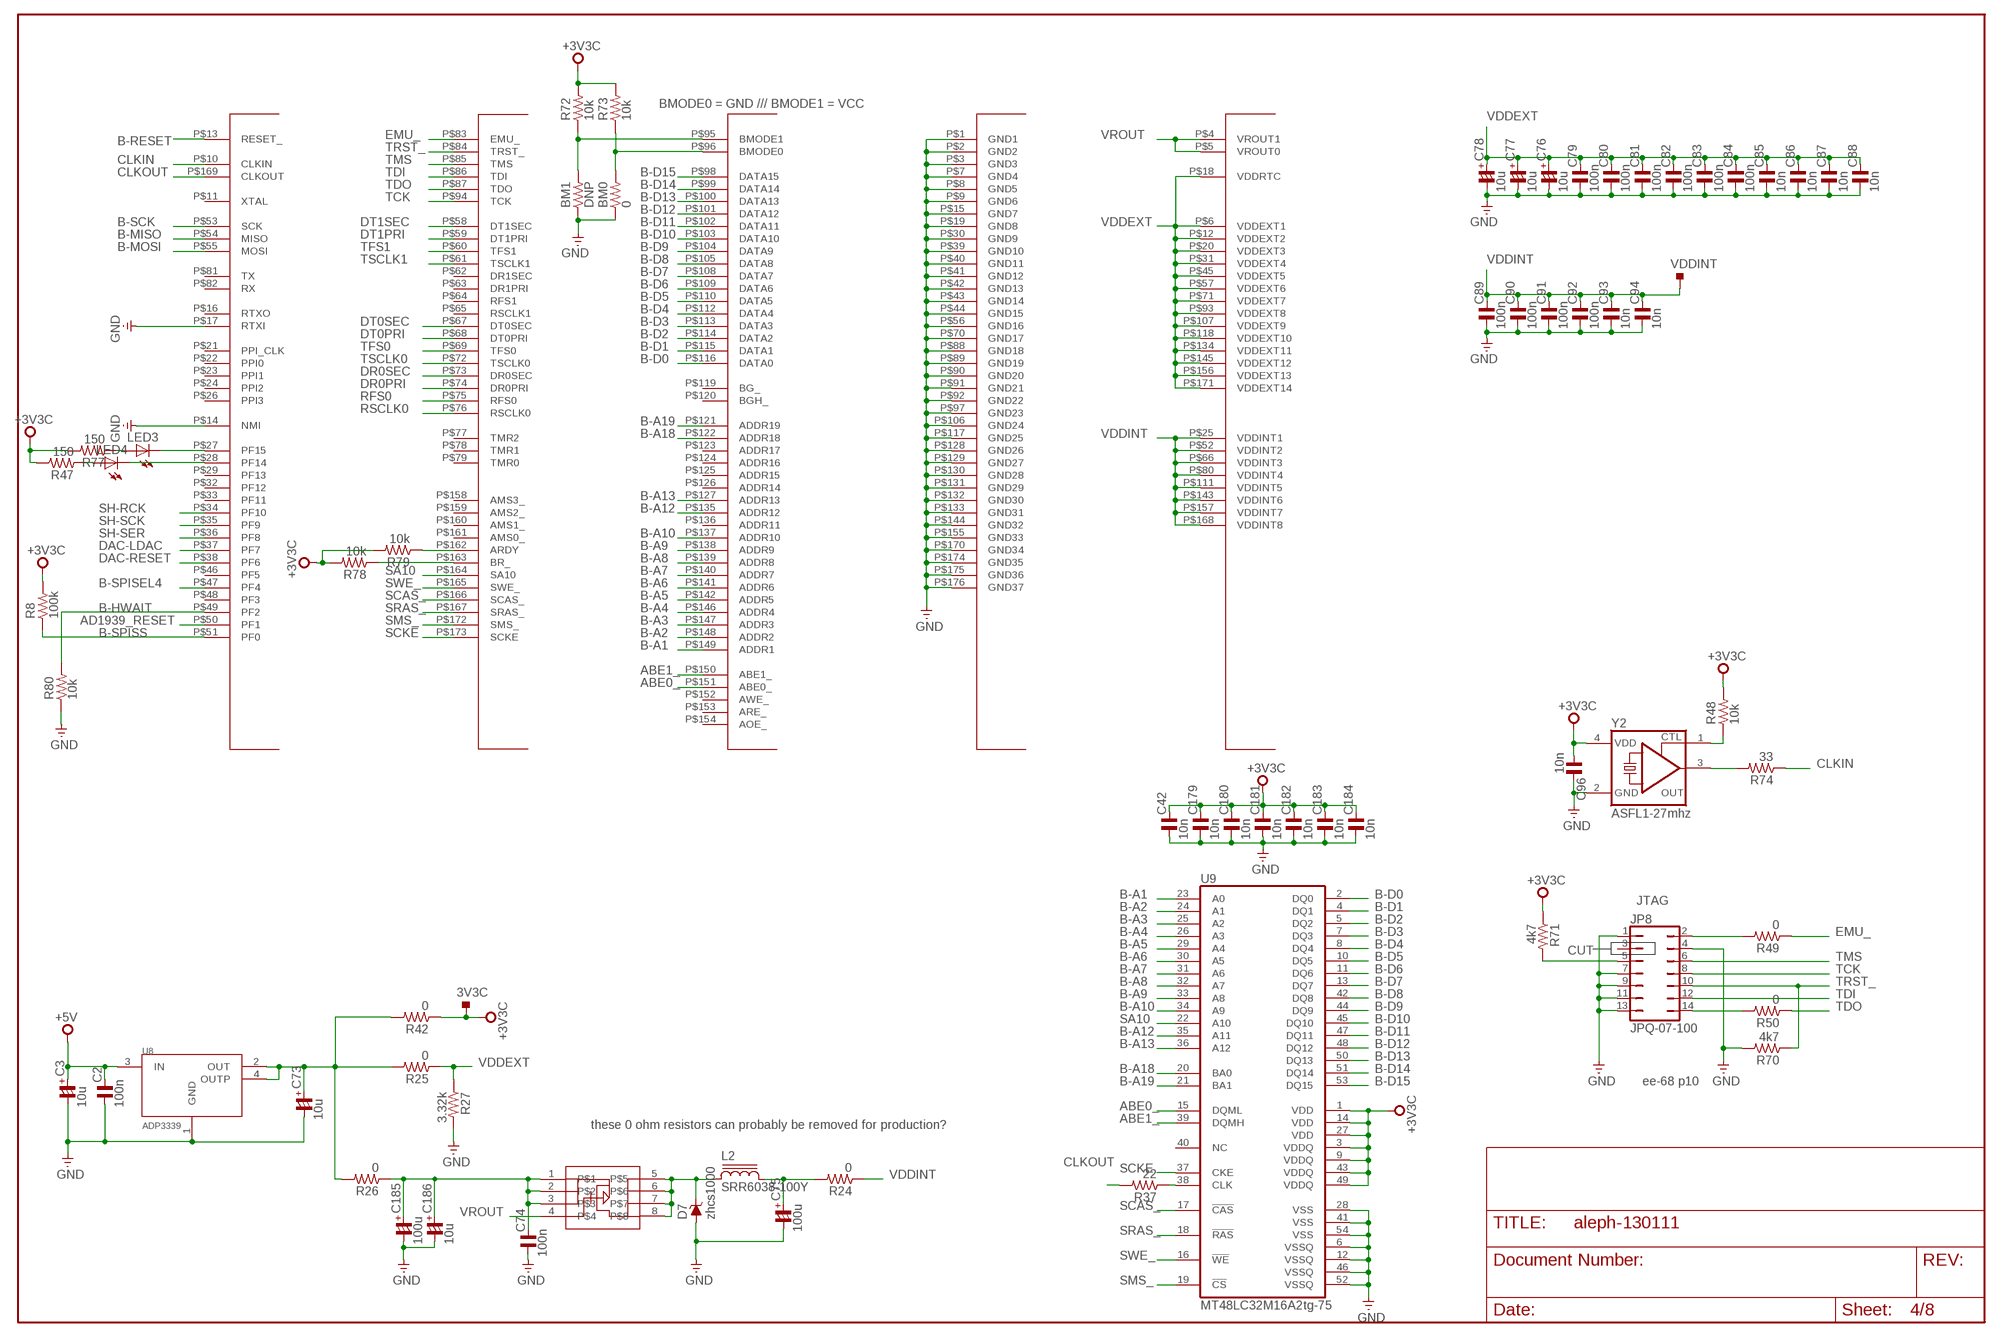
[diagram p3: schematic, sheet 4]

### Parts
3V3C  TPS-SMD-15R  [SMD-15R]
BM0  0  R_0603  [R0603]
BM1  DNP  R_0603  [R0603]
C2  100n  C_1206  [C1206]
C3  10u  CP_1206/T  [C1206/T]
C42  10n  C_0603  [C0603]
C73  10u  CP_1206/T  [C1206/T]
C74  100n  C_1206  [C1206]
C75  100u  CP_3528  [C3528/T]
C76  10u  CP_1206/T  [C1206/T]
C77  10u  CP_1206/T  [C1206/T]
C78  10u  CP_1206/T  [C1206/T]
C79  100n  C_0603  [C0603]
C80  100n  C_0603  [C0603]
C81  100n  C_0603  [C0603]
C82  100n  C_0603  [C0603]
C83  100n  C_0603  [C0603]
C84  100n  C_0603  [C0603]
C85  10n  C_0603  [C0603]
C86  10n  C_0603  [C0603]
C87  10n  C_0603  [C0603]
C88  10n  C_0603  [C0603]
C89  100n  C_0603  [C0603]
C90  100n  C_0603  [C0603]
C91  100n  C_0603  [C0603]
C92  100n  C_0603  [C0603]
C93  10n  C_0603  [C0603]
C94  10n  C_0603  [C0603]
C96  10n  C_0603  [C0603]
C179  10n  C_0603  [C0603]
C180  10n  C_0603  [C0603]
C181  10n  C_0603  [C0603]
C182  10n  C_0603  [C0603]
C183  10n  C_0603  [C0603]
C184  10n  C_0603  [C0603]
C185  100u  CP_1210/T  [C1210/T]
C186  10u  CP_1206/T  [C1206/T]
D7  zhcs1000  ZENER-DIODESOT23  [SOT23]
DSP1  BF533  [LQFP176]
JP8  JPQ-07-100  [JPQ-07]
L2  SRR6038-100Y  SRR6038  [SRR6038]
LED3  LEDCHIPLED_0805  [CHIPLED_0805]
LED4  LEDCHIPLED_0805  [CHIPLED_0805]
R8  100k  R_0603  [R0603]
R24  0  R_0603  [R0603]
R25  0  R_0603  [R0603]
R26  0  R_0603  [R0603]
R27  3.32k  R_0603  [R0603]
R37  22  R_0603  [R0603]
R42  0  R_0603  [R0603]
R47  150  R_0603  [R0603]
R48  10k  R_0603  [R0603]
R49  0  R_0603  [R0603]
R50  0  R_0603  [R0603]
R70  4k7  R_0603  [R0603]
R71  4k7  R_0603  [R0603]
R72  10k  R_0603  [R0603]
R73  10k  R_0603  [R0603]
R74  33  R_0603  [R0603]
R77  150  R_0603  [R0603]
R78  10k  R_0603  [R0603]
R79  10k  R_0603  [R0603]
R80  10k  R_0603  [R0603]
U8  ADP3339  [SOT223]
U9  MT48LC32M16A2tg-75  MT48LC16M16A2  [TSOP54]
U18  FDS9431A  [SO08]
VDDINT  TPS-SMD-10R  [SMD-10R]
Y2  ASFL1-27mhz  ASFL1  [ASFL1]

### Nets
+3V3C: 3V3C.TP C42.2 C96.1 C179.2 C180.2 C181.2 C182.2 C183.2 C184.2 R8.2 R42.1 R47.2 R48.2 R71.1 R72.2 R73.2 R77.2 R78.2 R79.2 U9.1(VDD) U9.3(VDDQ) U9.9(VDDQ) U9.14(VDD) U9.27(VDD) U9.43(VDDQ) U9.49(VDDQ) Y2.4(VDD) ; also sheet 5,8
+5V: C2.2 C3.+ U8.3(IN) ; also sheet 2,3
ABE0_: DSP1.P$151(ABE0_) U9.15(DQML)
ABE1_: DSP1.P$150(ABE1_) U9.39(DQMH)
AD1939_RESET: DSP1.P$50(PF1) ; also sheet 5
B-A1: DSP1.P$149(ADDR1) U9.23(A0)
B-A2: DSP1.P$148(ADDR2) U9.24(A1)
B-A3: DSP1.P$147(ADDR3) U9.25(A2)
B-A4: DSP1.P$146(ADDR4) U9.26(A3)
B-A5: DSP1.P$142(ADDR5) U9.29(A4)
B-A6: DSP1.P$141(ADDR6) U9.30(A5)
B-A7: DSP1.P$140(ADDR7) U9.31(A6)
B-A8: DSP1.P$139(ADDR8) U9.32(A7)
B-A9: DSP1.P$138(ADDR9) U9.33(A8)
B-A10: DSP1.P$137(ADDR10) U9.34(A9)
B-A12: DSP1.P$135(ADDR12) U9.35(A11)
B-A13: DSP1.P$127(ADDR13) U9.36(A12)
B-A18: DSP1.P$122(ADDR18) U9.20(BA0)
B-A19: DSP1.P$121(ADDR19) U9.21(BA1)
B-D0: DSP1.P$116(DATA0) U9.2(DQ0)
B-D1: DSP1.P$115(DATA1) U9.4(DQ1)
B-D2: DSP1.P$114(DATA2) U9.5(DQ2)
B-D3: DSP1.P$113(DATA3) U9.7(DQ3)
B-D4: DSP1.P$112(DATA4) U9.8(DQ4)
B-D5: DSP1.P$110(DATA5) U9.10(DQ5)
B-D6: DSP1.P$109(DATA6) U9.11(DQ6)
B-D7: DSP1.P$108(DATA7) U9.13(DQ7)
B-D8: DSP1.P$105(DATA8) U9.42(DQ8)
B-D9: DSP1.P$104(DATA9) U9.44(DQ9)
B-D10: DSP1.P$103(DATA10) U9.45(DQ10)
B-D11: DSP1.P$102(DATA11) U9.47(DQ11)
B-D12: DSP1.P$101(DATA12) U9.48(DQ12)
B-D13: DSP1.P$100(DATA13) U9.50(DQ13)
B-D14: DSP1.P$99(DATA14) U9.51(DQ14)
B-D15: DSP1.P$98(DATA15) U9.53(DQ15)
B-HWAIT: DSP1.P$49(PF2) R80.2 ; also sheet 1
B-MISO: DSP1.P$54(MISO) ; also sheet 1,5
B-MOSI: DSP1.P$55(MOSI) ; also sheet 1,5
B-RESET: DSP1.P$13(RESET_) ; also sheet 1
B-SCK: DSP1.P$53(SCK) ; also sheet 1,5
B-SPISEL4: DSP1.P$47(PF4) ; also sheet 5
B-SPISS: DSP1.P$51(PF0) R8.1 ; also sheet 1
BMODE0: BM0.2 DSP1.P$96(BMODE0) R73.1
BMODE1: BM1.2 DSP1.P$95(BMODE1) R72.1
CLKIN: DSP1.P$10(CLKIN) R74.1
CLKOUT: DSP1.P$169(CLKOUT) R37.2
DAC-LDAC: DSP1.P$37(PF7) ; also sheet 8
DAC-RESET: DSP1.P$38(PF6) ; also sheet 8
DR0PRI: DSP1.P$74(DR0PRI) ; also sheet 5
DR0SEC: DSP1.P$73(DR0SEC) ; also sheet 5
DT0PRI: DSP1.P$68(DT0PRI) ; also sheet 5
DT0SEC: DSP1.P$67(DT0SEC) ; also sheet 5
DT1PRI: DSP1.P$59(DT1PRI) ; also sheet 8
DT1SEC: DSP1.P$58(DT1SEC) ; also sheet 8
EMU_: DSP1.P$83(EMU_) R49.1
GND: BM0.1 BM1.1 C2.1 C3.- C42.1 C73.- C74.1 C75.- C76.- C77.- C78.- C79.1 C80.1 C81.1 C82.1 C83.1 C84.1 C85.1 C86.1 C87.1 C88.1 C89.1 C90.1 C91.1 C92.1 C93.1 C94.1 C96.2 C179.1 C180.1 C181.1 C182.1 C183.1 C184.1 C185.- C186.- D7.1(A) DSP1.P$1(GND1) DSP1.P$2(GND2) DSP1.P$3(GND3) DSP1.P$7(GND4) DSP1.P$8(GND5) DSP1.P$9(GND6) DSP1.P$14(NMI) DSP1.P$15(GND7) DSP1.P$17(RTXI) DSP1.P$19(GND8) DSP1.P$30(GND9) DSP1.P$39(GND10) DSP1.P$40(GND11) DSP1.P$41(GND12) DSP1.P$42(GND13) DSP1.P$43(GND14) DSP1.P$44(GND15) DSP1.P$56(GND16) DSP1.P$70(GND17) DSP1.P$88(GND18) DSP1.P$89(GND19) DSP1.P$90(GND20) DSP1.P$91(GND21) DSP1.P$92(GND22) DSP1.P$97(GND23) DSP1.P$106(GND24) DSP1.P$117(GND25) DSP1.P$128(GND26) DSP1.P$129(GND27) DSP1.P$130(GND28) DSP1.P$131(GND29) DSP1.P$132(GND30) DSP1.P$133(GND31) DSP1.P$144(GND32) DSP1.P$155(GND33) DSP1.P$170(GND34) DSP1.P$174(GND35) DSP1.P$175(GND36) DSP1.P$176(GND37) JP8.1 JP8.4 JP8.7 JP8.9 JP8.11 JP8.13 R27.2 R70.2 R80.1 U8.1(GND) U9.6(VSSQ) U9.12(VSSQ) U9.28(VSS) U9.41(VSS) U9.46(VSSQ) U9.52(VSSQ) U9.54(VSS) Y2.2(GND) ; also sheet 1,2,3,5
N$16: C73.+ R25.2 R26.2 R42.2 U8.2(OUT) U8.4(OUTP)
N$18: C74.2 C185.+ C186.+ R26.1 U18.1 U18.2 U18.3
N$19: D7.3(C) L2.1 U18.5 U18.6 U18.7 U18.8
N$22: C75.+ L2.2 R24.2
N$24: R37.1 U9.38(CLK)
N$25: R48.1 Y2.1(CTL)
N$26: JP8.2 R49.2
N$28: JP8.5 R71.2
N$29: DSP1.P$163(BR_) R78.1
N$31: JP8.14 R50.2
N$35: DSP1.P$162(ARDY) R79.1
N$38: R74.2 Y2.3(OUT)
N$60: DSP1.P$27(PF15) LED3.C
N$64: DSP1.P$28(PF14) LED4.C
N$66: LED3.A R77.1
N$67: LED4.A R47.1
RFS0: DSP1.P$75(RFS0) ; also sheet 5
RSCLK0: DSP1.P$76(RSCLK0) ; also sheet 5
SA10: DSP1.P$164(SA10) U9.22(A10)
SCAS_: DSP1.P$166(SCAS_) U9.17(!CAS!)
SCKE: DSP1.P$173(SCKE) U9.37(CKE)
SH-RCK: DSP1.P$34(PF10) ; also sheet 8
SH-SCK: DSP1.P$35(PF9) ; also sheet 8
SH-SER: DSP1.P$36(PF8) ; also sheet 8
SMS_: DSP1.P$172(SMS_) U9.19(!CS!)
SRAS_: DSP1.P$167(SRAS_) U9.18(!RAS!)
SWE_: DSP1.P$165(SWE_) U9.16(!WE!)
TCK: DSP1.P$94(TCK) JP8.8
TDI: DSP1.P$86(TDI) JP8.12
TDO: DSP1.P$87(TDO) R50.1
TFS0: DSP1.P$69(TFS0) ; also sheet 5
TFS1: DSP1.P$60(TFS1) ; also sheet 8
TMS: DSP1.P$85(TMS) JP8.6
TRST_: DSP1.P$84(TRST_) JP8.10 R70.1
TSCLK0: DSP1.P$72(TSCLK0) ; also sheet 5
TSCLK1: DSP1.P$61(TSCLK1) ; also sheet 8
VDDEXT: C76.+ C77.+ C78.+ C79.2 C80.2 C81.2 C82.2 C83.2 C84.2 C85.2 C86.2 C87.2 C88.2 DSP1.P$6(VDDEXT1) DSP1.P$12(VDDEXT2) DSP1.P$18(VDDRTC) DSP1.P$20(VDDEXT3) DSP1.P$31(VDDEXT4) DSP1.P$45(VDDEXT5) DSP1.P$57(VDDEXT6) DSP1.P$71(VDDEXT7) DSP1.P$93(VDDEXT8) DSP1.P$107(VDDEXT9) DSP1.P$118(VDDEXT10) DSP1.P$134(VDDEXT11) DSP1.P$145(VDDEXT12) DSP1.P$156(VDDEXT13) DSP1.P$171(VDDEXT14) R25.1 R27.1
VDDINT: C89.2 C90.2 C91.2 C92.2 C93.2 C94.2 DSP1.P$25(VDDINT1) DSP1.P$52(VDDINT2) DSP1.P$66(VDDINT3) DSP1.P$80(VDDINT4) DSP1.P$111(VDDINT5) DSP1.P$143(VDDINT6) DSP1.P$157(VDDINT7) DSP1.P$168(VDDINT8) R24.1 VDDINT.TP
VROUT: DSP1.P$4(VROUT1) DSP1.P$5(VROUT0) U18.4
Unconnected: DSP1.P$11(XTAL) DSP1.P$16(RTXO) DSP1.P$21(PPI_CLK) DSP1.P$22(PPI0) DSP1.P$23(PPI1) DSP1.P$24(PPI2) DSP1.P$26(PPI3) DSP1.P$29(PF13) DSP1.P$32(PF12) DSP1.P$33(PF11) DSP1.P$46(PF5) DSP1.P$48(PF3) DSP1.P$62(DR1SEC) DSP1.P$63(DR1PRI) DSP1.P$64(RFS1) DSP1.P$65(RSCLK1) DSP1.P$77(TMR2) DSP1.P$78(TMR1) DSP1.P$79(TMR0) DSP1.P$81(TX) DSP1.P$82(RX) DSP1.P$119(BG_) DSP1.P$120(BGH_) DSP1.P$123(ADDR17) DSP1.P$124(ADDR16) DSP1.P$125(ADDR15) DSP1.P$126(ADDR14) DSP1.P$136(ADDR11) DSP1.P$152(AWE_) DSP1.P$153(ARE_) DSP1.P$154(AOE_) DSP1.P$158(AMS3_) DSP1.P$159(AMS2_) DSP1.P$160(AMS1_) DSP1.P$161(AMS0_) JP8.3 U9.40(NC)

### Notes on the sheet
- BMODE0 = GND /// BMODE1 = VCC
- JTAG
- CUT
- ee-68 p10
- these 0 ohm resistors can probably be removed for production?

## Sheet 5 of 8
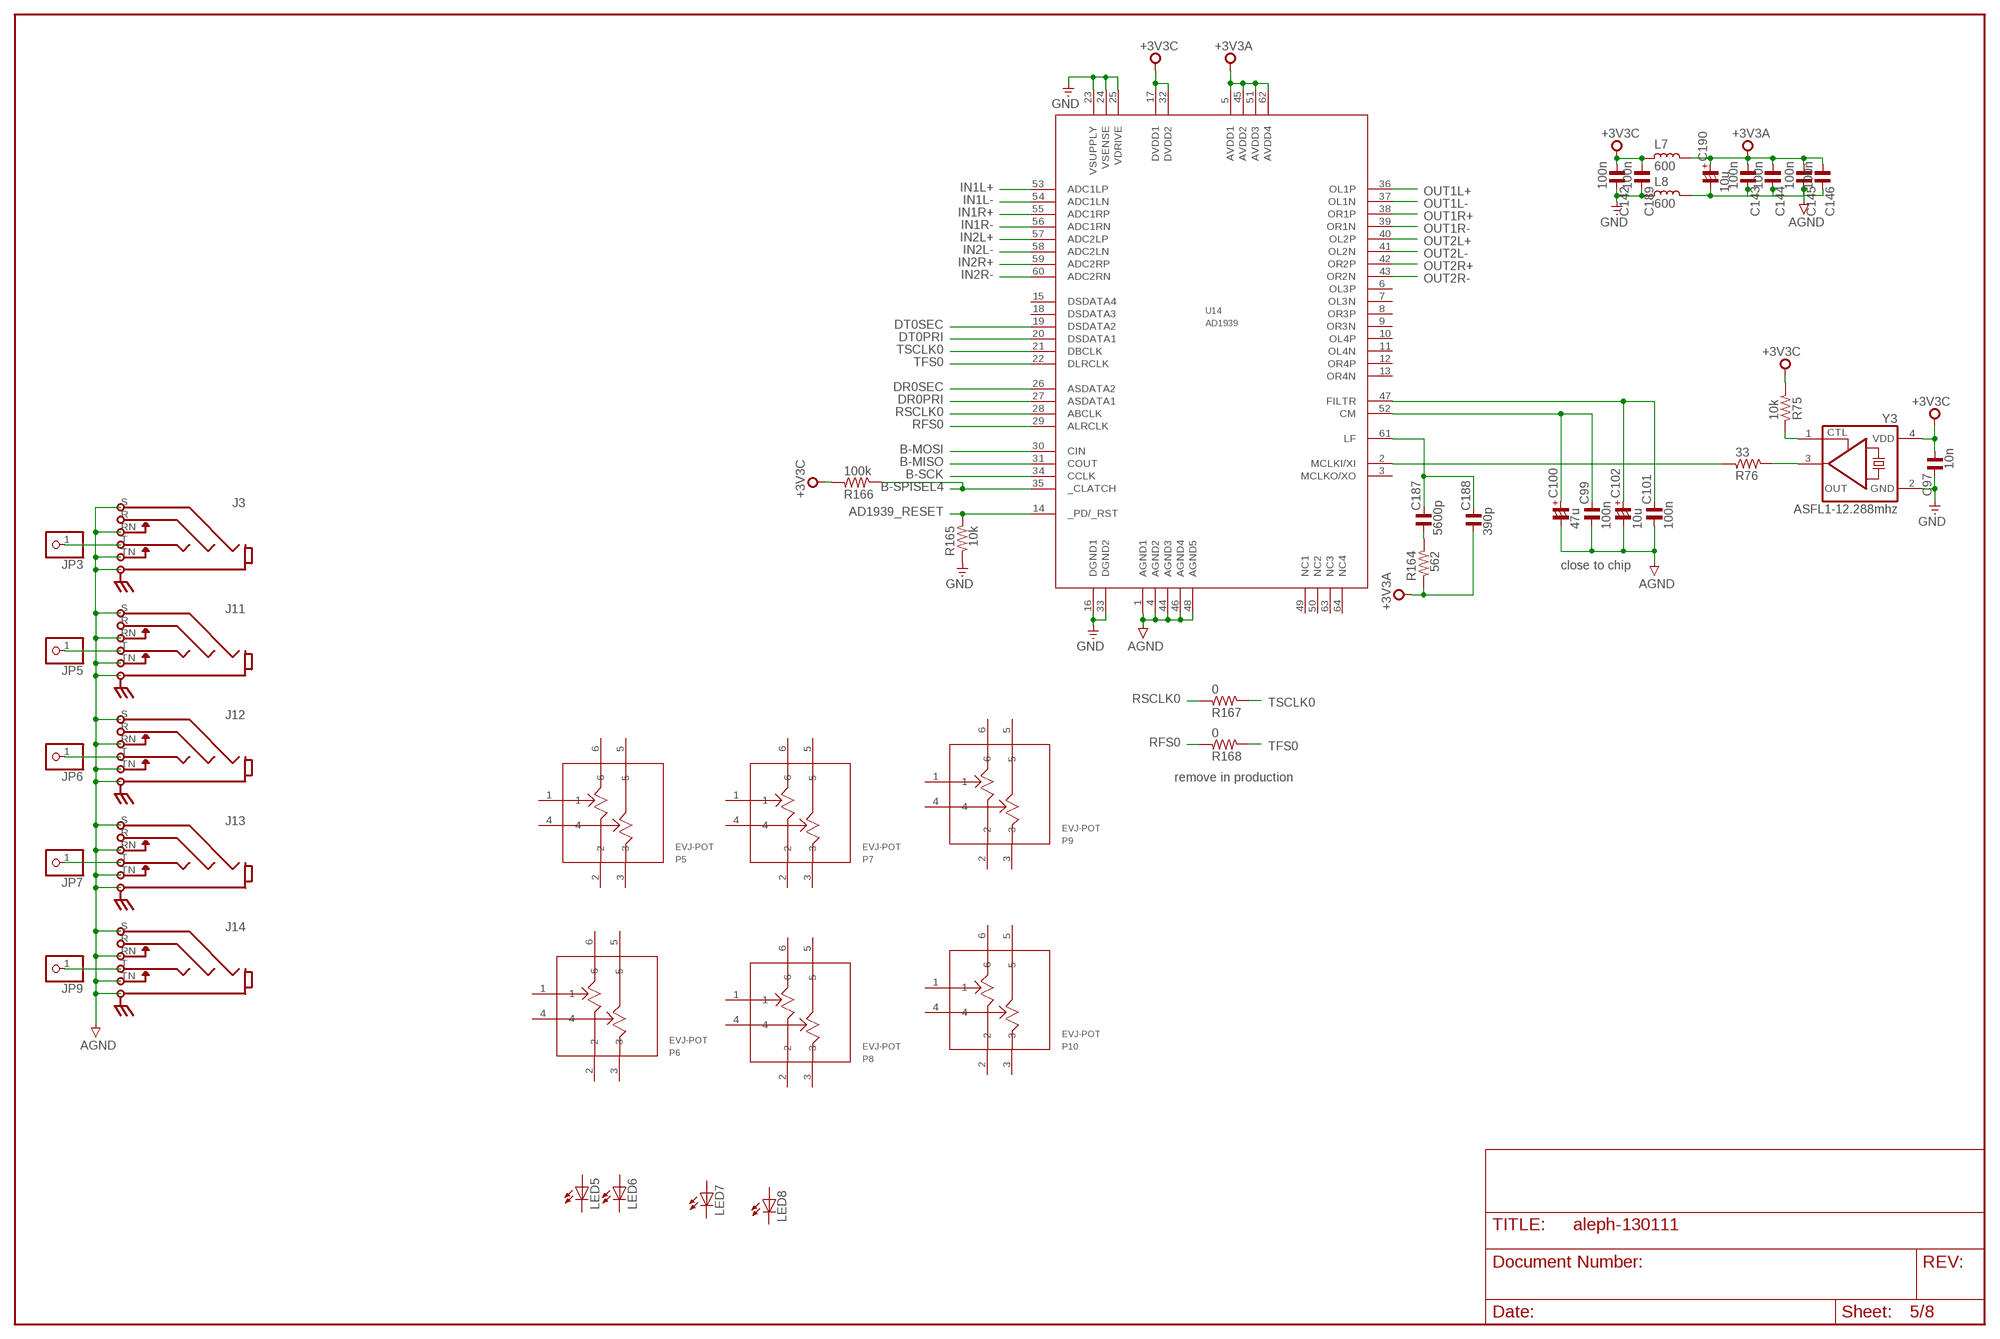
[diagram p4: schematic, sheet 5]

### Parts
C97  10n  C_0603  [C0603]
C99  100n  C_0603  [C0603]
C100  47u  CP_1206/T  [C1206/T]
C101  100n  C_0603  [C0603]
C102  10u  CP_1206/T  [C1206/T]
C142  100n  C_0603  [C0603]
C143  100n  C_0603  [C0603]
C144  100n  C_0603  [C0603]
C145  100n  C_0603  [C0603]
C146  100n  C_0603  [C0603]
C187  5600p  C_0603  [C0603]
C188  390p  C_0603  [C0603]
C189  100n  C_0603  [C0603]
C190  10u  CP_1206/T  [C1206/T]
J3  STEREOSW2GND  [NEUTRIK-NRJ6HM-1]
J11  STEREOSW2GND  [NEUTRIK-NRJ6HM-1]
J12  STEREOSW2GND  [NEUTRIK-NRJ6HM-1]
J13  STEREOSW2GND  [NEUTRIK-NRJ6HM-1]
J14  STEREOSW2GND  [NEUTRIK-NRJ6HM-1]
JP3  PINHD-1X1  [1X01]
JP5  PINHD-1X1  [1X01]
JP6  PINHD-1X1  [1X01]
JP7  PINHD-1X1  [1X01]
JP9  PINHD-1X1  [1X01]
L7  600  L_1206  [L1206]
L8  600  L_1206  [L1206]
LED5  LEDCHIPLED_0805  [CHIPLED_0805]
LED6  LEDCHIPLED_0805  [CHIPLED_0805]
LED7  LEDCHIPLED_0805  [CHIPLED_0805]
LED8  LEDCHIPLED_0805  [CHIPLED_0805]
P5  EVJ-POT  [EVJ-POT]
P6  EVJ-POT  [EVJ-POT]
P7  EVJ-POT  [EVJ-POT]
P8  EVJ-POT  [EVJ-POT]
P9  EVJ-POT  [EVJ-POT]
P10  EVJ-POT  [EVJ-POT]
R75  10k  R_0603  [R0603]
R76  33  R_0603  [R0603]
R164  562  R_0603  [R0603]
R165  10k  R_0603  [R0603]
R166  100k  R_0603  [R0603]
R167  0  R_0603  [R0603]
R168  0  R_0603  [R0603]
U14  AD1939  [SQFP-S-10X10-64]
Y3  ASFL1-12.288mhz  ASFL1  [ASFL1]

### Nets
+3V3A: C143.1 C144.1 C145.1 C146.1 C188.1 C190.+ L7.1 R164.2 U14.5(AVDD1) U14.45(AVDD2) U14.51(AVDD3) U14.62(AVDD4) ; also sheet 6,7,8
+3V3C: C97.1 C142.1 C189.1 L7.2 R75.2 R166.1 U14.17(DVDD1) U14.32(DVDD2) Y3.4(VDD) ; also sheet 4,8
AD1939_RESET: R165.1 U14.14(_PD/_RST) ; also sheet 4
AGND: C99.1 C100.- C101.1 C102.- C143.2 C144.2 C145.2 C146.2 C190.- J3.RN J3.S J3.TN J11.RN J11.S J11.TN J12.RN J12.S J12.TN J13.RN J13.S J13.TN J14.RN J14.S J14.TN L8.1 U14.1(AGND1) U14.4(AGND2) U14.44(AGND3) U14.46(AGND4) U14.48(AGND5) ; also sheet 2,3,6,7,8
B-MISO: U14.31(COUT) ; also sheet 1,4
B-MOSI: U14.30(CIN) ; also sheet 1,4
B-SCK: U14.34(CCLK) ; also sheet 1,4
B-SPISEL4: R166.2 U14.35(_CLATCH) ; also sheet 4
DR0PRI: U14.27(ASDATA1) ; also sheet 4
DR0SEC: U14.26(ASDATA2) ; also sheet 4
DT0PRI: U14.20(DSDATA1) ; also sheet 4
DT0SEC: U14.19(DSDATA2) ; also sheet 4
GND: C97.2 C142.2 C189.2 L8.2 R165.2 U14.16(DGND1) U14.23(VSUPPLY) U14.24(VSENSE) U14.25(VDRIVE) U14.33(DGND2) Y3.2(GND) ; also sheet 1,2,3,4
IN1L+: U14.53(ADC1LP) ; also sheet 7
IN1L-: U14.54(ADC1LN) ; also sheet 7
IN1R+: U14.55(ADC1RP)
IN1R-: U14.56(ADC1RN)
IN2L+: U14.57(ADC2LP)
IN2L-: U14.58(ADC2LN)
IN2R+: U14.59(ADC2RP)
IN2R-: U14.60(ADC2RN)
N$36: R75.1 Y3.1(CTL)
N$57: R76.2 Y3.3(OUT)
N$59: R76.1 U14.2(MCLKI/XI)
N$61: C101.2 C102.+ U14.47(FILTR)
N$62: C99.2 C100.+ U14.52(CM)
N$63: C187.2 C188.2 U14.61(LF)
N$65: C187.1 R164.1
N$84: J13.T JP7.1
N$85: J12.T JP6.1
N$86: J11.T JP5.1
N$87: J3.T JP3.1
N$88: J14.T JP9.1
OUT1L+: U14.36(OL1P) ; also sheet 6
OUT1L-: U14.37(OL1N) ; also sheet 6
OUT1R+: U14.38(OR1P) ; also sheet 6
OUT1R-: U14.39(OR1N) ; also sheet 6
OUT2L+: U14.40(OL2P)
OUT2L-: U14.41(OL2N)
OUT2R+: U14.42(OR2P)
OUT2R-: U14.43(OR2N)
RFS0: R168.1 U14.29(ALRCLK) ; also sheet 4
RSCLK0: R167.1 U14.28(ABCLK) ; also sheet 4
TFS0: R168.2 U14.22(DLRCLK) ; also sheet 4
TSCLK0: R167.2 U14.21(DBCLK) ; also sheet 4
Unconnected: J3.R J11.R J12.R J13.R J14.R LED5.A LED5.C LED6.A LED6.C LED7.A LED7.C LED8.A LED8.C P5.1 P5.2 P5.3 P5.4 P5.5 P5.6 P6.1 P6.2 P6.3 P6.4 P6.5 P6.6 P7.1 P7.2 P7.3 P7.4 P7.5 P7.6 P8.1 P8.2 P8.3 P8.4 P8.5 P8.6 P9.1 P9.2 P9.3 P9.4 P9.5 P9.6 P10.1 P10.2 P10.3 P10.4 P10.5 P10.6 U14.3(MCLKO/XO) U14.6(OL3P) U14.7(OL3N) U14.8(OR3P) U14.9(OR3N) U14.10(OL4P) U14.11(OL4N) U14.12(OR4P) U14.13(OR4N) U14.15(DSDATA4) U14.18(DSDATA3) U14.49(NC1) U14.50(NC2) U14.63(NC3) U14.64(NC4)

### Notes on the sheet
- close to chip
- remove in production

## Sheet 6 of 8
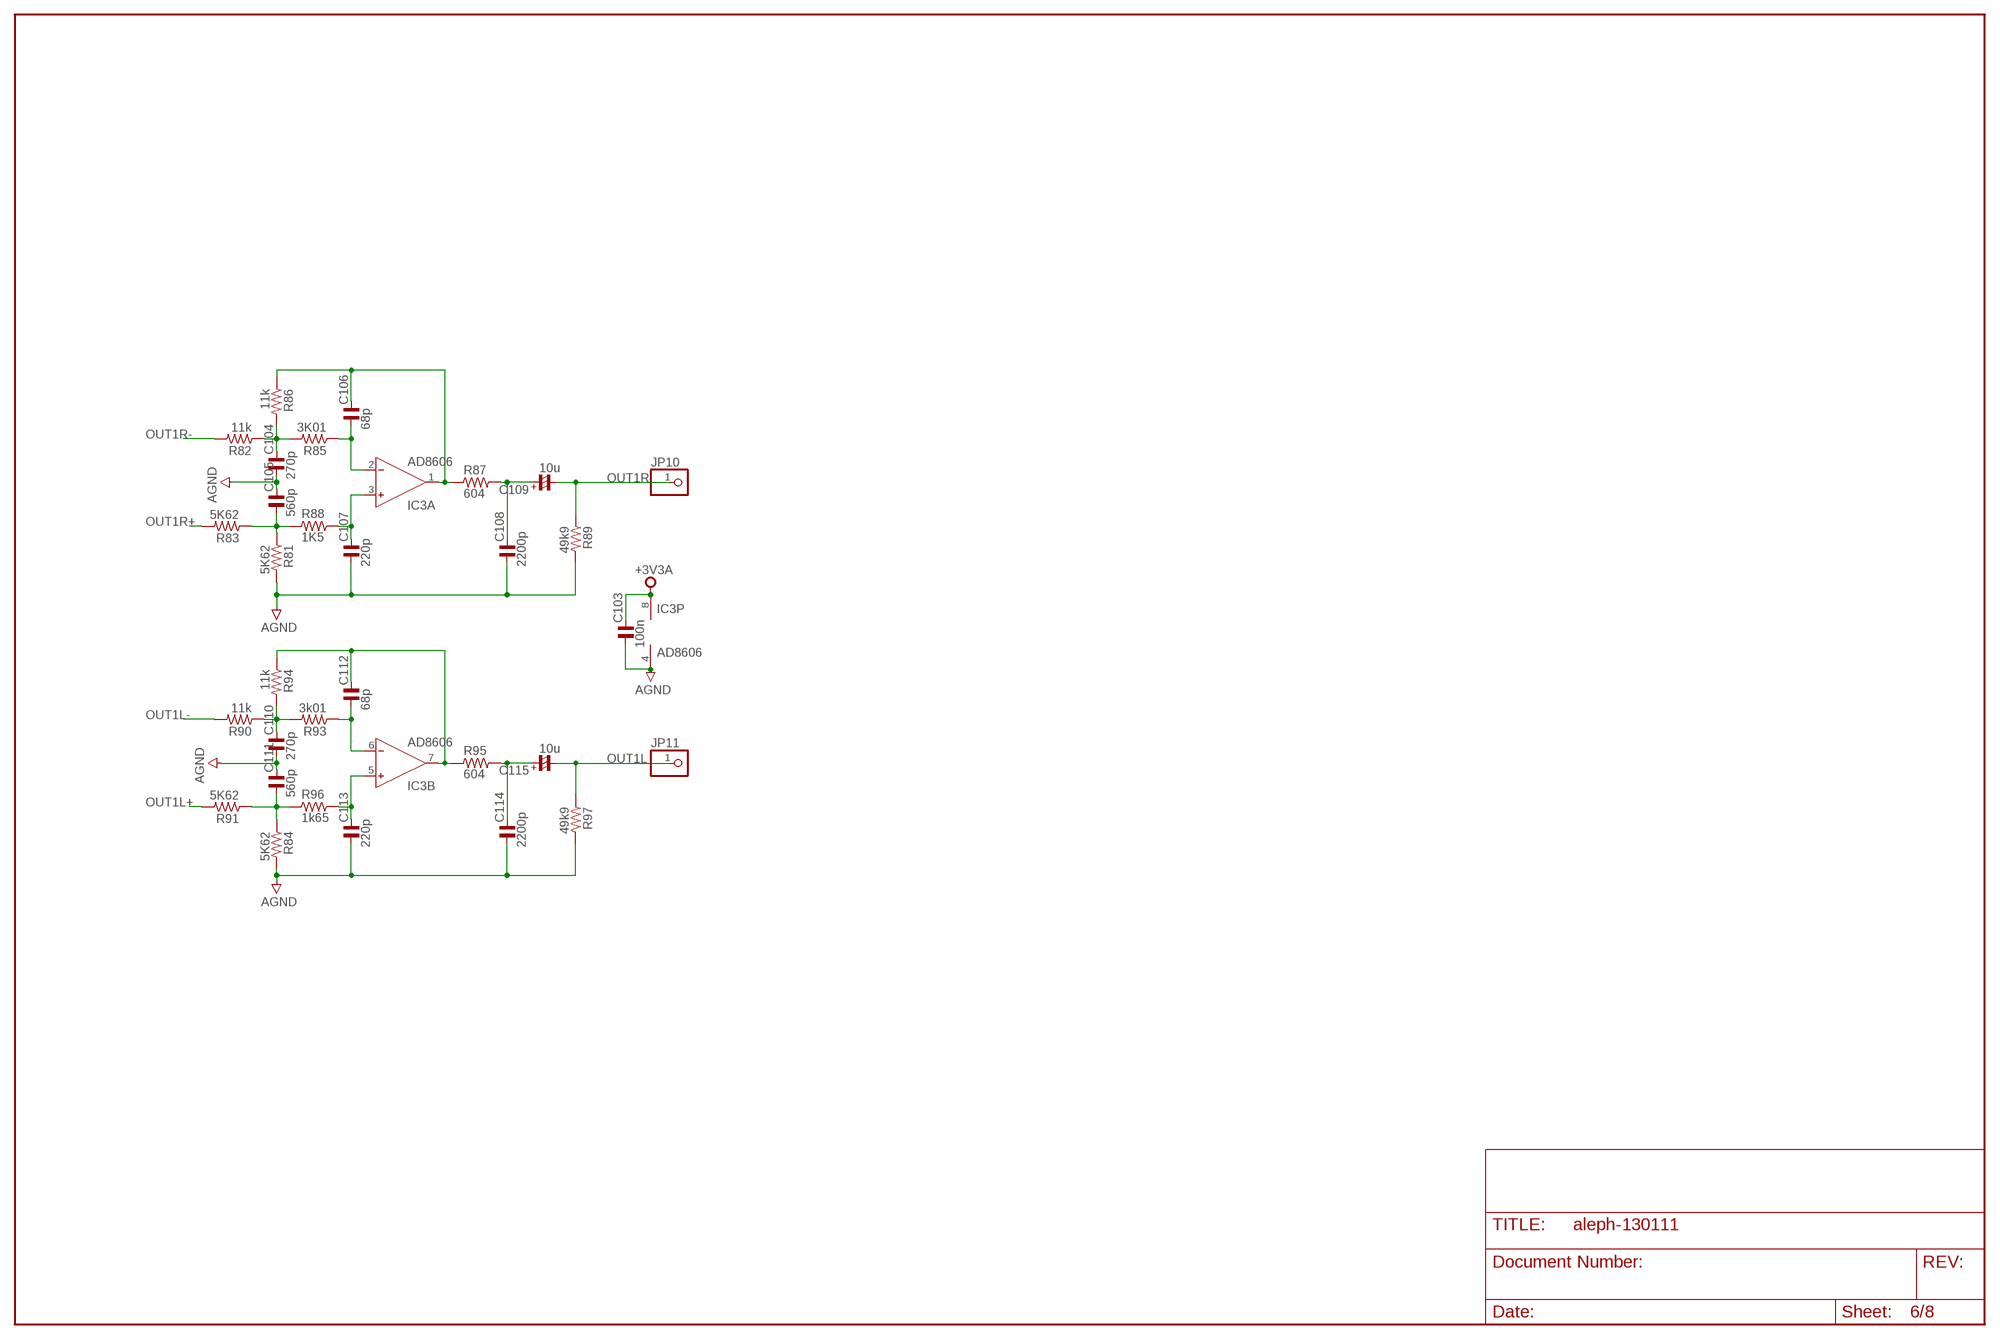
[diagram p5: schematic, sheet 6]

### Parts
C103  100n  C_0603  [C0603]
C104  270p  C_0603  [C0603]
C105  560p  C_0603  [C0603]
C106  68p  C_0603  [C0603]
C107  220p  C_0603  [C0603]
C108  2200p  C_0603  [C0603]
C109  10u  CP_1206/T  [C1206/T]
C110  270p  C_0603  [C0603]
C111  560p  C_0603  [C0603]
C112  68p  C_0603  [C0603]
C113  220p  C_0603  [C0603]
C114  2200p  C_0603  [C0603]
C115  10u  CP_1206/T  [C1206/T]
IC3  AD8606  AD8607R  [SO8]
JP10  PINHD-1X1  [1X01]
JP11  PINHD-1X1  [1X01]
R81  5K62  R_0603  [R0603]
R82  11k  R_0603  [R0603]
R83  5K62  R_0603  [R0603]
R84  5K62  R_0603  [R0603]
R85  3K01  R_0603  [R0603]
R86  11k  R_0603  [R0603]
R87  604  R_0603  [R0603]
R88  1K5  R_0603  [R0603]
R89  49k9  R_0603  [R0603]
R90  11k  R_0603  [R0603]
R91  5K62  R_0603  [R0603]
R93  3k01  R_0603  [R0603]
R94  11k  R_0603  [R0603]
R95  604  R_0603  [R0603]
R96  1k65  R_0603  [R0603]
R97  49k9  R_0603  [R0603]

### Nets
+3V3A: C103.2 IC3.8(P:V+) ; also sheet 5,7,8
AGND: C103.1 C104.1 C105.2 C107.1 C108.1 C110.1 C111.2 C113.1 C114.1 IC3.4(P:V-) R81.2 R84.2 R89.2 R97.2 ; also sheet 2,3,5,7,8
N$68: C104.2 R82.1 R85.2 R86.2
N$69: C105.1 R81.1 R83.1 R88.1
N$70: C107.2 IC3.3(A:IN+) R88.2
N$71: C106.2 IC3.1(A:OUT) R86.1 R87.1
N$72: C108.2 C109.+ R87.2
N$73: C110.2 R90.1 R93.2 R94.2
N$74: C106.1 IC3.2(A:IN-) R85.1
N$75: C111.1 R84.1 R91.1 R96.1
N$76: C113.2 IC3.5(B:IN+) R96.2
N$77: C112.2 IC3.7(B:OUT) R94.1 R95.1
N$78: C114.2 C115.+ R95.2
N$79: C112.1 IC3.6(B:IN-) R93.1
OUT1L: C115.- JP11.1 R97.1
OUT1L+: R91.2 ; also sheet 5
OUT1L-: R90.2 ; also sheet 5
OUT1R: C109.- JP10.1 R89.1
OUT1R+: R83.2 ; also sheet 5
OUT1R-: R82.2 ; also sheet 5

## Sheet 7 of 8
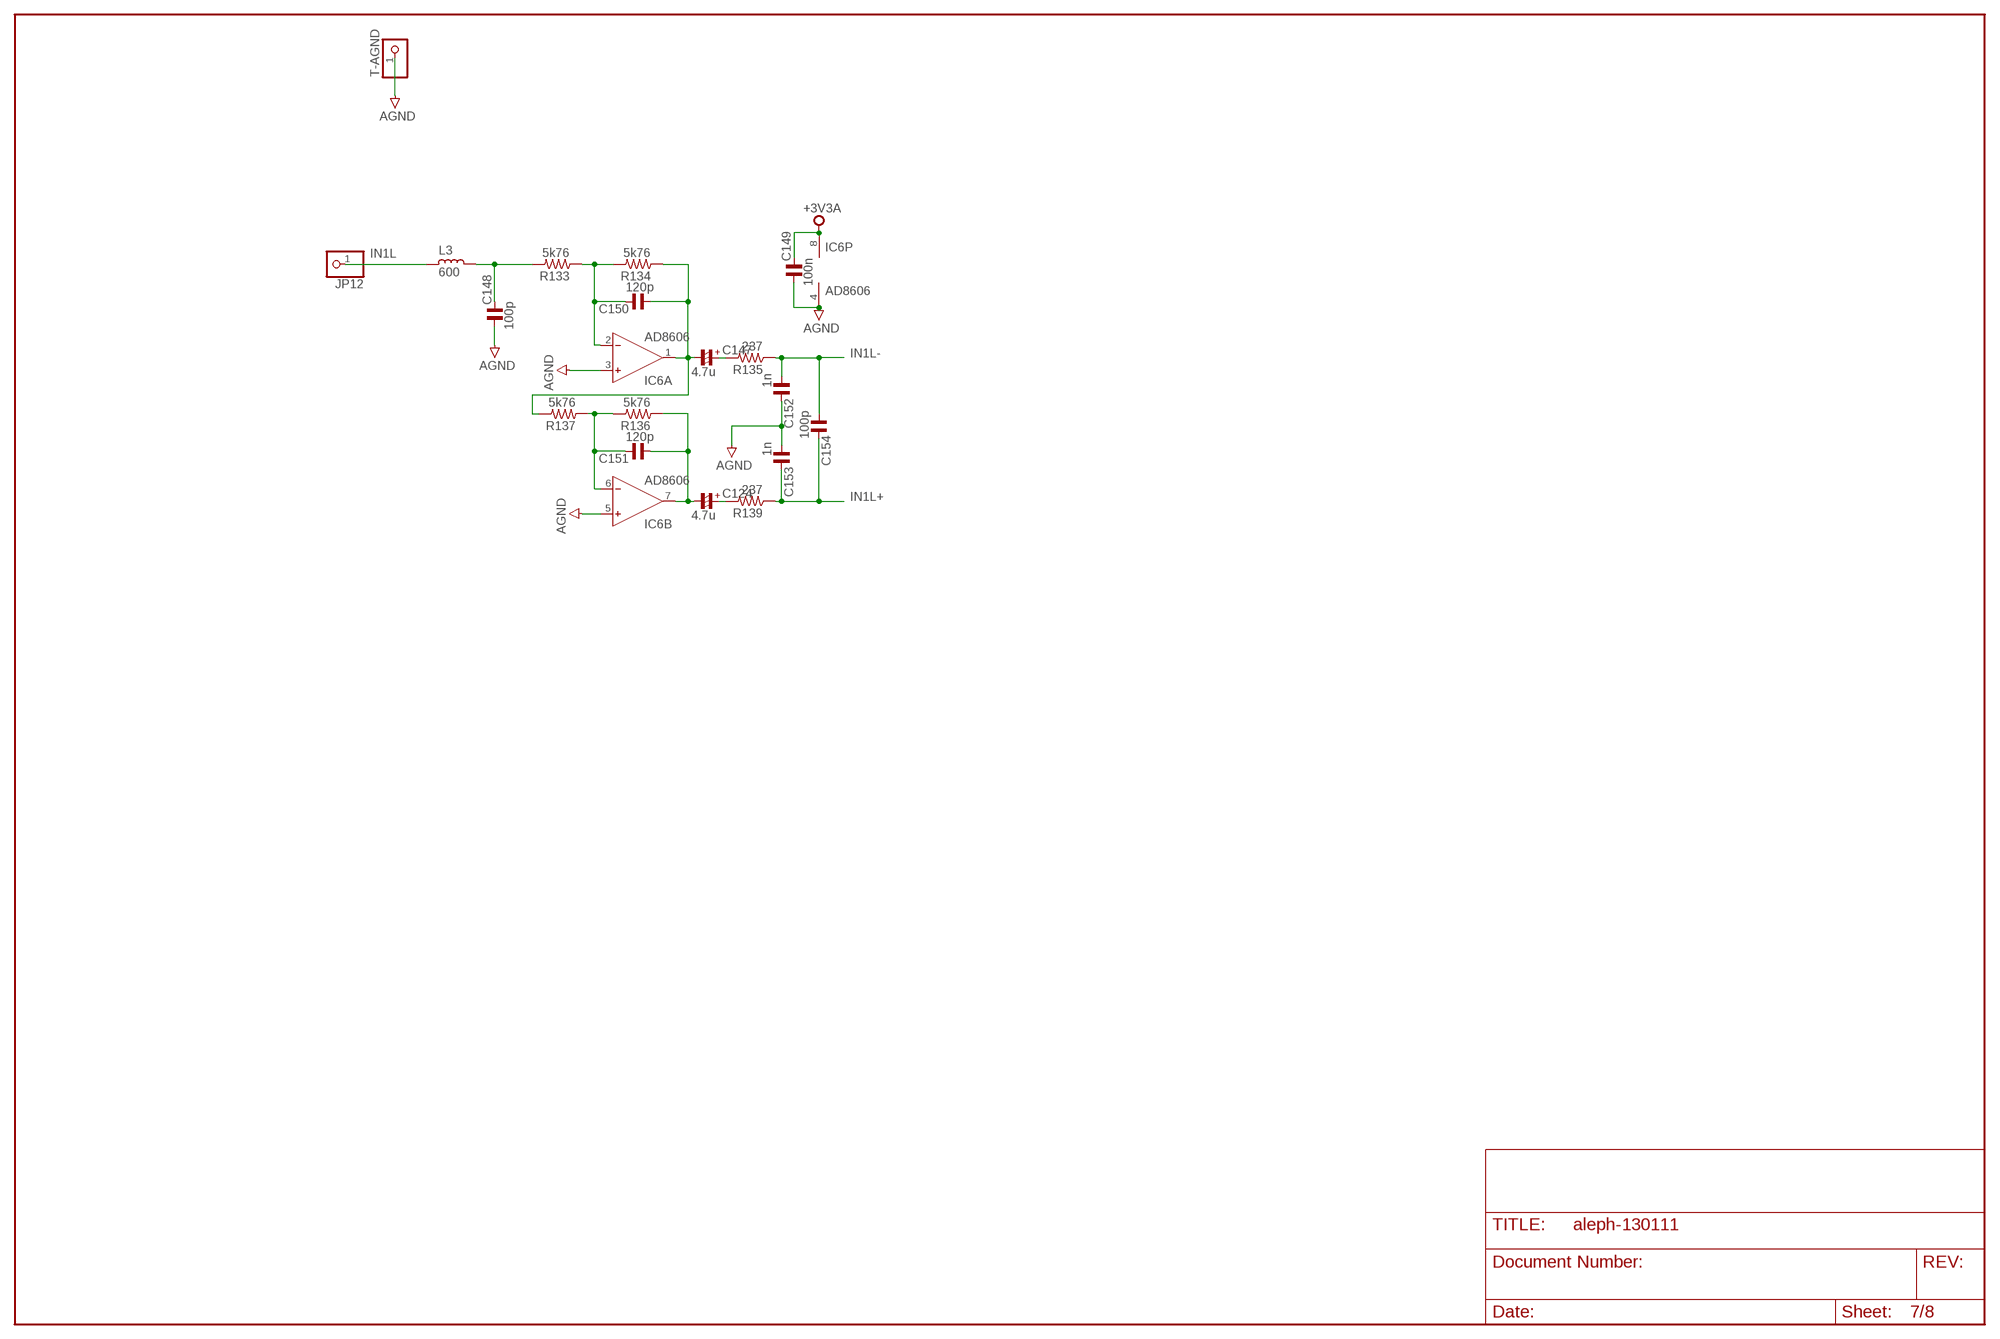
[diagram p6: schematic, sheet 7]

### Parts
C124  4.7u  CP_1206/T  [C1206/T]
C147  4.7u  CP_1206/T  [C1206/T]
C148  100p  C_0603  [C0603]
C149  100n  C_0603  [C0603]
C150  120p  C_0603  [C0603]
C151  120p  C_0603  [C0603]
C152  1n  C_0603  [C0603]
C153  1n  C_0603  [C0603]
C154  100p  C_0603  [C0603]
IC6  AD8606  AD8607R  [SO8]
JP12  PINHD-1X1  [1X01]
L3  600  L_1206  [L1206]
R133  5k76  R_0603  [R0603]
R134  5k76  R_0603  [R0603]
R135  237  R_0603  [R0603]
R136  5k76  R_0603  [R0603]
R137  5k76  R_0603  [R0603]
R139  237  R_0603  [R0603]
T-AGND  PINHD-1X1  [1X01]

### Nets
+3V3A: C149.2 IC6.8(P:V+) ; also sheet 5,6,8
AGND: C148.1 C149.1 C152.2 C153.1 IC6.3(A:IN+) IC6.4(P:V-) IC6.5(B:IN+) T-AGND.1 ; also sheet 2,3,5,6,8
IN1L: JP12.1 L3.2
IN1L+: C153.2 C154.2 R139.1 ; also sheet 5
IN1L-: C152.1 C154.1 R135.1 ; also sheet 5
N$81: C124.+ R139.2
N$82: C147.+ R135.2
N$104: C147.- C150.1 IC6.1(A:OUT) R134.1 R137.2
N$105: C124.- C151.1 IC6.7(B:OUT) R136.1
N$106: C148.2 L3.1 R133.2
N$108: C150.2 IC6.2(A:IN-) R133.1 R134.2
N$110: C151.2 IC6.6(B:IN-) R136.2 R137.1

## Sheet 8 of 8
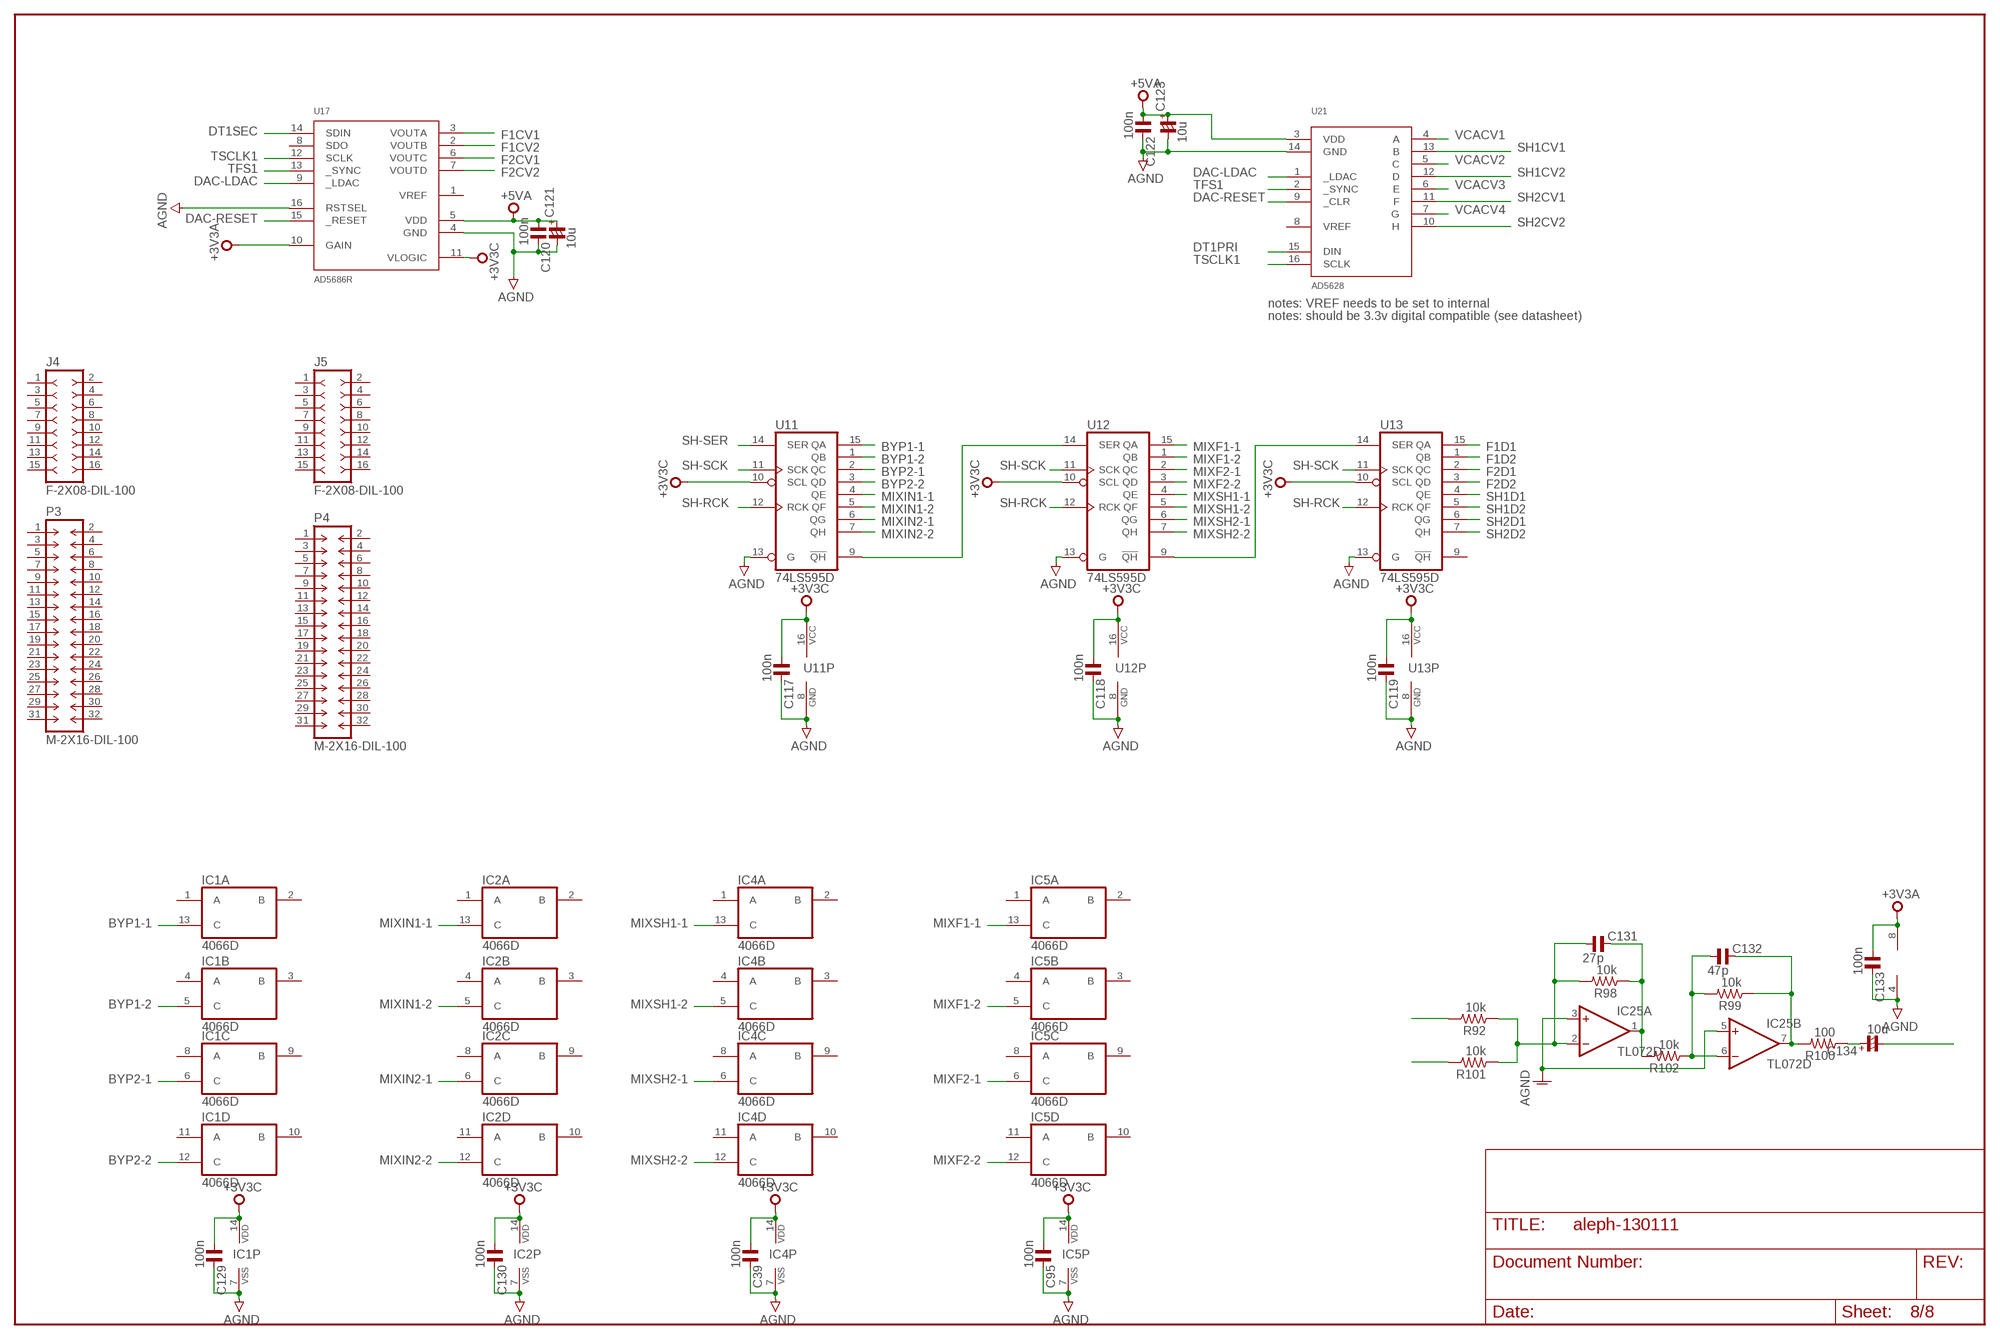
[diagram p7: schematic, sheet 8]

### Parts
C39  100n  C_0603  [C0603]
C95  100n  C_0603  [C0603]
C117  100n  C_0603  [C0603]
C118  100n  C_0603  [C0603]
C119  100n  C_0603  [C0603]
C120  100n  C_0603  [C0603]
C121  10u  CP_1206/T  [C1206/T]
C122  100n  C_0603  [C0603]
C123  10u  CP_1206/T  [C1206/T]
C129  100n  C_0603  [C0603]
C130  100n  C_0603  [C0603]
C131  27p  C_0603  [C0603]
C132  47p  C_0603  [C0603]
C133  100n  C_0603  [C0603]
C134  10u  CP_1206/T  [C1206/T]
IC1  4066D  [SO14]
IC2  4066D  [SO14]
IC4  4066D  [SO14]
IC5  4066D  [SO14]
IC25  TL072D  [SO08]
J4  F-2X08-DIL-100  [DIL-100-2X08]
J5  F-2X08-DIL-100  [DIL-100-2X08]
P3  M-2X16-DIL-100  [DIL-100-2X16]
P4  M-2X16-DIL-100  [DIL-100-2X16]
R92  10k  R_0603  [R0603]
R98  10k  R_0603  [R0603]
R99  10k  R_0603  [R0603]
R100  100  R_0603  [R0603]
R101  10k  R_0603  [R0603]
R102  10k  R_0603  [R0603]
U11  74LS595D  [SO16]
U12  74LS595D  [SO16]
U13  74LS595D  [SO16]
U17  AD5686R  [TSSOP16]
U21  AD5628  [TSSOP16]

### Nets
+3V3A: C133.1 IC25.8(P:V+) U17.10(GAIN) ; also sheet 5,6,7
+3V3C: C39.1 C95.1 C117.1 C118.1 C119.1 C129.1 C130.1 IC1.14(P:VDD) IC2.14(P:VDD) IC4.14(P:VDD) IC5.14(P:VDD) U11.10(SCL) U11.16(VCC) U12.10(SCL) U12.16(VCC) U13.10(SCL) U13.16(VCC) U17.11(VLOGIC) ; also sheet 4,5
+5VA: C120.1 C121.+ C122.1 C123.+ U17.5(VDD) U21.3(VDD) ; also sheet 2,3
AGND: C39.2 C95.2 C117.2 C118.2 C119.2 C120.2 C121.- C122.2 C123.- C129.2 C130.2 C133.2 IC1.7(P:VSS) IC2.7(P:VSS) IC4.7(P:VSS) IC5.7(P:VSS) IC25.3(A:+IN) IC25.4(P:V-) IC25.5(B:+IN) U11.8(GND) U11.13(G) U12.8(GND) U12.13(G) U13.8(GND) U13.13(G) U17.4(GND) U17.16(RSTSEL) U21.14(GND) ; also sheet 2,3,5,6,7
BYP1-1: IC1.13(A:C) U11.15(QA)
BYP1-2: IC1.5(B:C) U11.1(QB)
BYP2-1: IC1.6(C:C) U11.2(QC)
BYP2-2: IC1.12(D:C) U11.3(QD)
DAC-LDAC: U17.9(_LDAC) U21.1(_LDAC) ; also sheet 4
DAC-RESET: U17.15(_RESET) U21.9(_CLR) ; also sheet 4
DT1PRI: U21.15(DIN) ; also sheet 4
DT1SEC: U17.14(SDIN) ; also sheet 4
F1CV1: U17.3(VOUTA)
F1CV2: U17.2(VOUTB)
F1D1: U13.15(QA)
F1D2: U13.1(QB)
F2CV1: U17.6(VOUTC)
F2CV2: U17.7(VOUTD)
F2D1: U13.2(QC)
F2D2: U13.3(QD)
MIXF1-1: IC5.13(A:C) U12.15(QA)
MIXF1-2: IC5.5(B:C) U12.1(QB)
MIXF2-1: IC5.6(C:C) U12.2(QC)
MIXF2-2: IC5.12(D:C) U12.3(QD)
MIXIN1-1: IC2.13(A:C) U11.4(QE)
MIXIN1-2: IC2.5(B:C) U11.5(QF)
MIXIN2-1: IC2.6(C:C) U11.6(QG)
MIXIN2-2: IC2.12(D:C) U11.7(QH)
MIXSH1-1: IC4.13(A:C) U12.4(QE)
MIXSH1-2: IC4.5(B:C) U12.5(QF)
MIXSH2-1: IC4.6(C:C) U12.6(QG)
MIXSH2-2: IC4.12(D:C) U12.7(QH)
N$80: C131.2 IC25.1(A:OUT) R98.1 R102.2
N$89: C132.1 IC25.6(B:-IN) R99.2 R102.1
N$111: C132.2 IC25.7(B:OUT) R99.1 R100.2
N$112: C134.+ R100.1
N$113: C134.-
N$114: R92.2
N$115: R101.2
N$121: U12.9(!QH!) U13.14(SER)
N$122: U11.9(!QH!) U12.14(SER)
S1: C131.1 IC25.2(A:-IN) R92.1 R98.2 R101.1
SH1CV1: U21.13(B)
SH1CV2: U21.12(D)
SH1D1: U13.4(QE)
SH1D2: U13.5(QF)
SH2CV1: U21.11(F)
SH2CV2: U21.10(H)
SH2D1: U13.6(QG)
SH2D2: U13.7(QH)
SH-RCK: U11.12(RCK) U12.12(RCK) U13.12(RCK) ; also sheet 4
SH-SCK: U11.11(SCK) U12.11(SCK) U13.11(SCK) ; also sheet 4
SH-SER: U11.14(SER) ; also sheet 4
TFS1: U17.13(_SYNC) U21.2(_SYNC) ; also sheet 4
TSCLK1: U17.12(SCLK) U21.16(SCLK) ; also sheet 4
VCACV1: U21.4(A)
VCACV2: U21.5(C)
VCACV3: U21.6(E)
VCACV4: U21.7(G)
Unconnected: IC1.1(A:A) IC1.2(A:B) IC1.3(B:B) IC1.4(B:A) IC1.8(C:A) IC1.9(C:B) IC1.10(D:B) IC1.11(D:A) IC2.1(A:A) IC2.2(A:B) IC2.3(B:B) IC2.4(B:A) IC2.8(C:A) IC2.9(C:B) IC2.10(D:B) IC2.11(D:A) IC4.1(A:A) IC4.2(A:B) IC4.3(B:B) IC4.4(B:A) IC4.8(C:A) IC4.9(C:B) IC4.10(D:B) IC4.11(D:A) IC5.1(A:A) IC5.2(A:B) IC5.3(B:B) IC5.4(B:A) IC5.8(C:A) IC5.9(C:B) IC5.10(D:B) IC5.11(D:A) J4.1 J4.2 J4.3 J4.4 J4.5 J4.6 J4.7 J4.8 J4.9 J4.10 J4.11 J4.12 J4.13 J4.14 J4.15 J4.16 J5.1 J5.2 J5.3 J5.4 J5.5 J5.6 J5.7 J5.8 J5.9 J5.10 J5.11 J5.12 J5.13 J5.14 J5.15 J5.16 P3.1 P3.2 P3.3 P3.4 P3.5 P3.6 P3.7 P3.8 P3.9 P3.10 P3.11 P3.12 P3.13 P3.14 P3.15 P3.16 P3.17 P3.18 P3.19 P3.20 P3.21 P3.22 P3.23 P3.24 P3.25 P3.26 P3.27 P3.28 P3.29 P3.30 P3.31 P3.32 P4.1 P4.2 P4.3 P4.4 P4.5 P4.6 P4.7 P4.8 P4.9 P4.10 P4.11 P4.12 P4.13 P4.14 P4.15 P4.16 P4.17 P4.18 P4.19 P4.20 P4.21 P4.22 P4.23 P4.24 P4.25 P4.26 P4.27 P4.28 P4.29 P4.30 P4.31 P4.32 U13.9(!QH!) U17.1(VREF) U17.8(SDO) U21.8(VREF)

### Notes on the sheet
- notes: VREF needs to be set to internal
- notes: should be 3.3v digital compatible (see datasheet)

## Library data of the parts
3V3 3V3C 5V GND VDDINT VDDOUT = testpoint:TPS: TEST POINT PAD
BM0 BM1 R1-R42 R47-R102 R133-R137 R139 R162 R164-R168 = rc-master-smd:R_: RESISTOR
C1 C2 C4-C47 C50 C52 C53 C55-C68 C70 C72 C74 C79-C97 C99 C101 C103-C108 C110-C114 C117-C120 C122 C125 C126 C129-C133 C142-C146 C148-C154 C179-C184 C187-C189 = rc-master-smd:C_: NON-POLARIZED CAP
C3 C48 C49 C51 C54 C69 C71 C73 C75-C78 C100 C102 C109 C115 C121 C123 C124 C127 C128 C134 C147 C185 C186 C190 = rc-master-smd:CP_: POLARIZED CAP
D1 D2 = diode:MBRS360T3: Schottkey Power Rectifier - 3A, 60V
D3-D6 = diode:1N4148: DIODE high speed (Philips)
D7 = diode:ZENER-DIODE: Z-Diode
DSP1 = monome-inc:BF533
GND0 JP3 JP5-JP7 JP9-JP12 T-AGND = pinhead:PINHD-1X1: PIN HEADER
IC1 IC2 IC4 IC5 = 40xx:4066: Quad bilateral ANALOG SWITCH
IC3 IC6 = analog-devices:AD8607: Precision Micropower, Low Noise CMOS, Rail-to-Rail Input/Output Operational Amplifiers Source: http://www.analog.com/static/imported-files/data_sheets/AD8603_8607_8609.pdf; MPN: AD8607ARMZ-R2; OC_FARNELL: 1651293; OC_NEWARK: 19M8927
IC25 = linear:TL072: OP AMP
J1 J19 = monome-inc:SJ1-3533NG: RIGHT ANGLE STEREO JACK 3.5mm
J2 = con-cuistack:PJ-102AH/BH: DC Power Jack PJ-102AH (2.1 x 5.5 MM) PJ-102BH (2.5 x 5.5 MM)
J3 J6 J7 J11-J14 = Audio Jacks 0.25 inch:STEREOSW2GND: 1/4" stereo jack, switched (unswitched sleeve), with chassis ground connection
J4 J5 = con-headers-jp:F-2X08-: FEMALE HEADER
J8 = monome-inc:USBA-VERT
J9 = monome-inc:USB_TYPE_B: BERG USB connector
J10 = monome-inc:PHA2U
J15-J18 = monome-inc:STX-3680
JP1 = atmel-avr32:AVR-JTAG-10: AVR JTAG Debug/Programming Header
JP4 = pinhead:PINHD-1X20: PIN HEADER
JP8 = jumpers:JPQ-07-: Jumper Block
K0 K1-K3 KM = monome-inc:PVA1
L1 = inductor-coilcraft:MSS1278: SMT Power Inductor
L2 = inductor-bourns:SRR6038: POWER INDUCTOR
L3 L7 L8 = rc-master-smd:L_: INDUCTOR
LED1-LED8 = led:LED: LED OSRAM: - CHIPLED LG R971, LG N971, LY N971, LG Q971, LY Q971, LO R971, LY R971 LH N974, LH R974 LS Q976, LO Q976, LY Q976 LO Q996 - Hyper CHIPLED LW Q18S LB Q993, LB Q99A, LB R99A - SideLED LS A670, LO A670, LY A670, LG A670, LP A670 LB A673, LV A673, LT A673, LW A673 LH A674 LY A675 LS A676, LA A676, LO A676, LY A676, LW A676 LS A679, LY A679, LG A679 - Hyper Micro SIDELED® LS Y876, LA Y876, LO Y876, LY Y876 LT Y87S - SmartLED LW L88C, LW L88S LB L89C, LB L89S, LG L890 LS L89K, LO L89K, LY L89K LS L896, LA L896, LO L896, LY L896 - TOPLED LS T670, LO T670, LY T670, LG T670, LP T670 LSG T670, LSP T670, LSY T670, LOP T670, LYG T670 LG T671, LOG T671, LSG T671 LB T673, LV T673, LT T673, LW T673 LH T674 LS T676, LA T676, LO T676, LY T676, LB T676, LH T676, LSB T676, LW T676 LB T67C, LV T67C, LT T67C, LS T67K, LO T67K, LY T67K, LW E67C LS E67B, LA E67B, LO E67B, LY E67B, LB E67C, LV E67C, LT E67C LW T67C LS T679, LY T679, LG T679 LS T770, LO T770, LY T770, LG T770, LP T770 LB T773, LV T773, LT T773, LW T773 LH T774 LS E675, LA E675, LY E675, LS T675 LS T776, LA T776, LO T776, LY T776, LB T776 LHGB T686 LT T68C, LB T68C - Hyper Mini TOPLED® LB M676 - Mini TOPLED Santana® LG M470 LS M47K, LO M47K, LY M47K Source: http://www.osram.convergy.de LUXEON: - LUMILED® LXK2-PW12-R00, LXK2-PW12-S00, LXK2-PW14-U00, LXK2-PW14-V00 LXK2-PM12-R00, LXK2-PM12-S00, LXK2-PM14-U00 LXK2-PE12-Q00, LXK2-PE12-R00, LXK2-PE12-S00, LXK2-PE14-T00, LXK2-PE14-U00 LXK2-PB12-K00, LXK2-PB12-L00, LXK2-PB12-M00, LXK2-PB14-N00, LXK2-PB14-P00, LXK2-PB14-Q00 LXK2-PR12-L00, LXK2-PR12-M00, LXK2-PR14-Q00, LXK2-PR14-R00 LXK2-PD12-Q00, LXK2-PD12-R00, LXK2-PD12-S00 LXK2-PH12-R00, LXK2-PH12-S00 LXK2-PL12-P00, LXK2-PL12-Q00, LXK2-PL12-R00 Source: www.luxeon.com KINGBRIGHT: KA-3528ASYC Source: www.kingbright.com
P1 P2 = con-headers-jp:M-2X14-: MALE HEADER
P3 P4 = con-headers-jp:M-2X16-: MALE HEADER
P5-P10 = monome-inc:EVJ-POT: audio pot
U1 = atmel-avr32:AT32UC3A0128/0256/0512: AT32UC3A0128/0256/0512
U2 = ftdi-chip:FT232RL: USB UART
U3 = memory-cypress:CY62167EV30-Z: SRAM 16-Mbit (1M x 16 / 2M x 8)
U4 = monome-inc:TPS2020
U5 = monome-inc:AD7923
U6 = monome-inc:LM2678
U7 U8 = monome-inc:ADP3339
U9 = monome-inc:MT48LC16M16A2: SDRAM 4 Meg x 16 x 4 banks
U10 = diode:LM4040: VOLTAGE REFERENCE
U11-U13 = 74xx-us:74*595: 8-bit SHIFT REGISTER, output latch
U14 = monome-inc:AD1939
U17 = monome-inc:AD5686R
U18 = monome-inc:FDS9431A
U19 = 74xx-us:74*14: Hex schmitt trigger INVERTER
U20 = monome-inc:SN74LVC2G14
U21 = monome-inc:AD5628
U$1 = monome-inc:PANASONIC-EVQ
U$2-U$5 = monome-inc:BOURNS-EM14
U$6 = monome-inc:SDMMC: SD MMC Card holder 4UCON part #06132 - easy to solder
U$7 U$11-U$13 = diode:BAS70-04: Silicon Schottky Diodes General-purpose diode for high-speed switching
U$10 = monome-inc:NHD-2.7
Y1 = crystal:CRYTAL: CRYSTAL
Y2 Y3 = crystal:ASFL1: CRYSTAL OSCILLATOR - Abracon